# EAGLE design Athena-r1p0 (EAGLE 9.6.2)

## Sheet 1 of 6
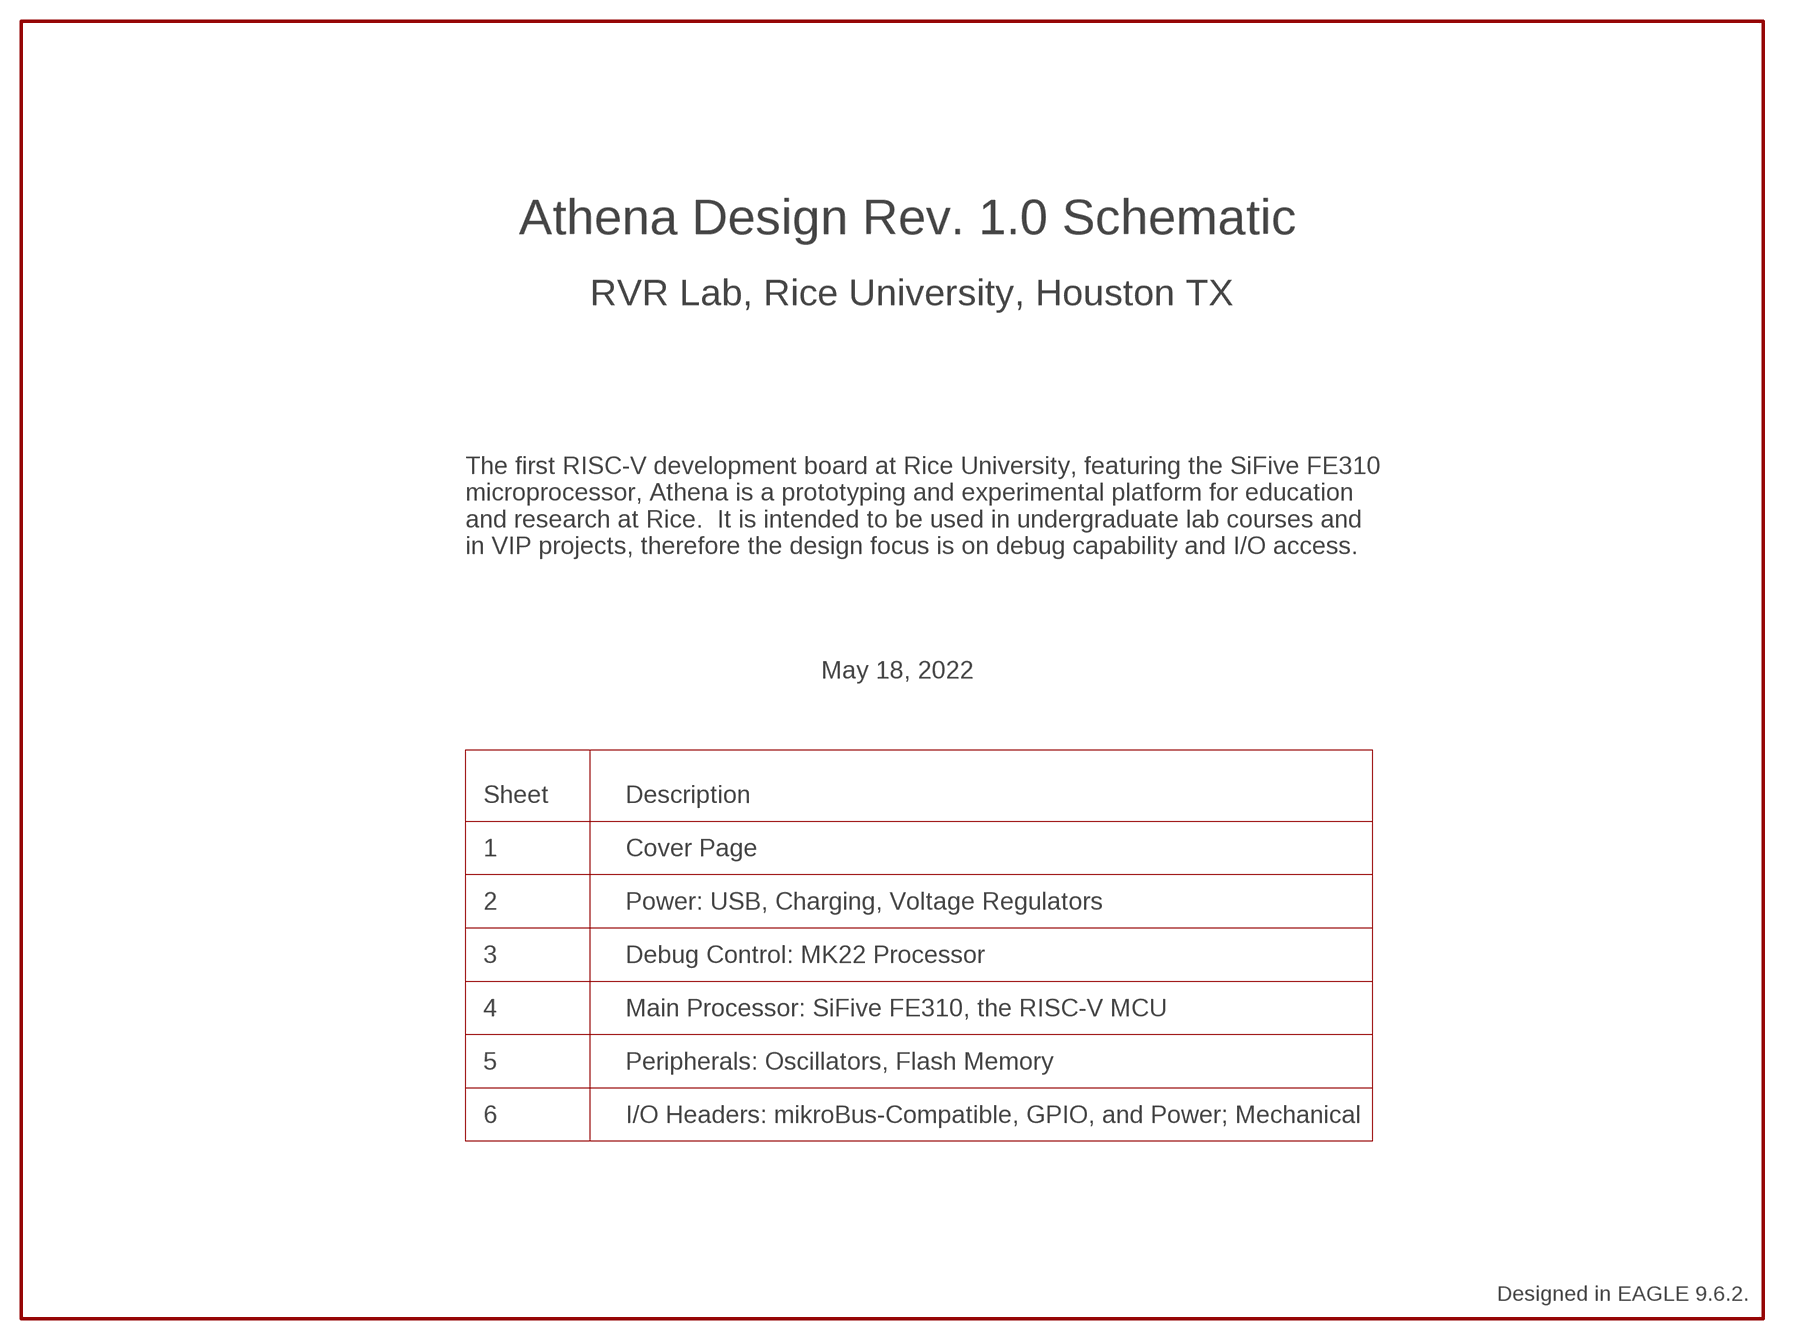
[diagram p0: schematic, sheet 1]

### Notes on the sheet
- Athena Design Rev. 1.0 Schematic
- RVR Lab, Rice University, Houston TX
- The first RISC-V development board at Rice University, featuring the SiFive FE310
  microprocessor, Athena is a prototyping and experimental platform for education
  and research at Rice.  It is intended to be used in undergraduate lab courses and
  in VIP projects, therefore the design focus is on debug capability and I/O access.
- May 18, 2022
- Sheet | Description
- 1 | Cover Page
- 2 | Power: USB, Charging, Voltage Regulators
- 3 | Debug Control: MK22 Processor
- 4 | Main Processor: SiFive FE310, the RISC-V MCU
- 5 | Peripherals: Oscillators, Flash Memory
- 6 | I/O Headers: mikroBus-Compatible, GPIO, and Power; Mechanical
- Designed in EAGLE 9.6.2.

## Sheet 2 of 6
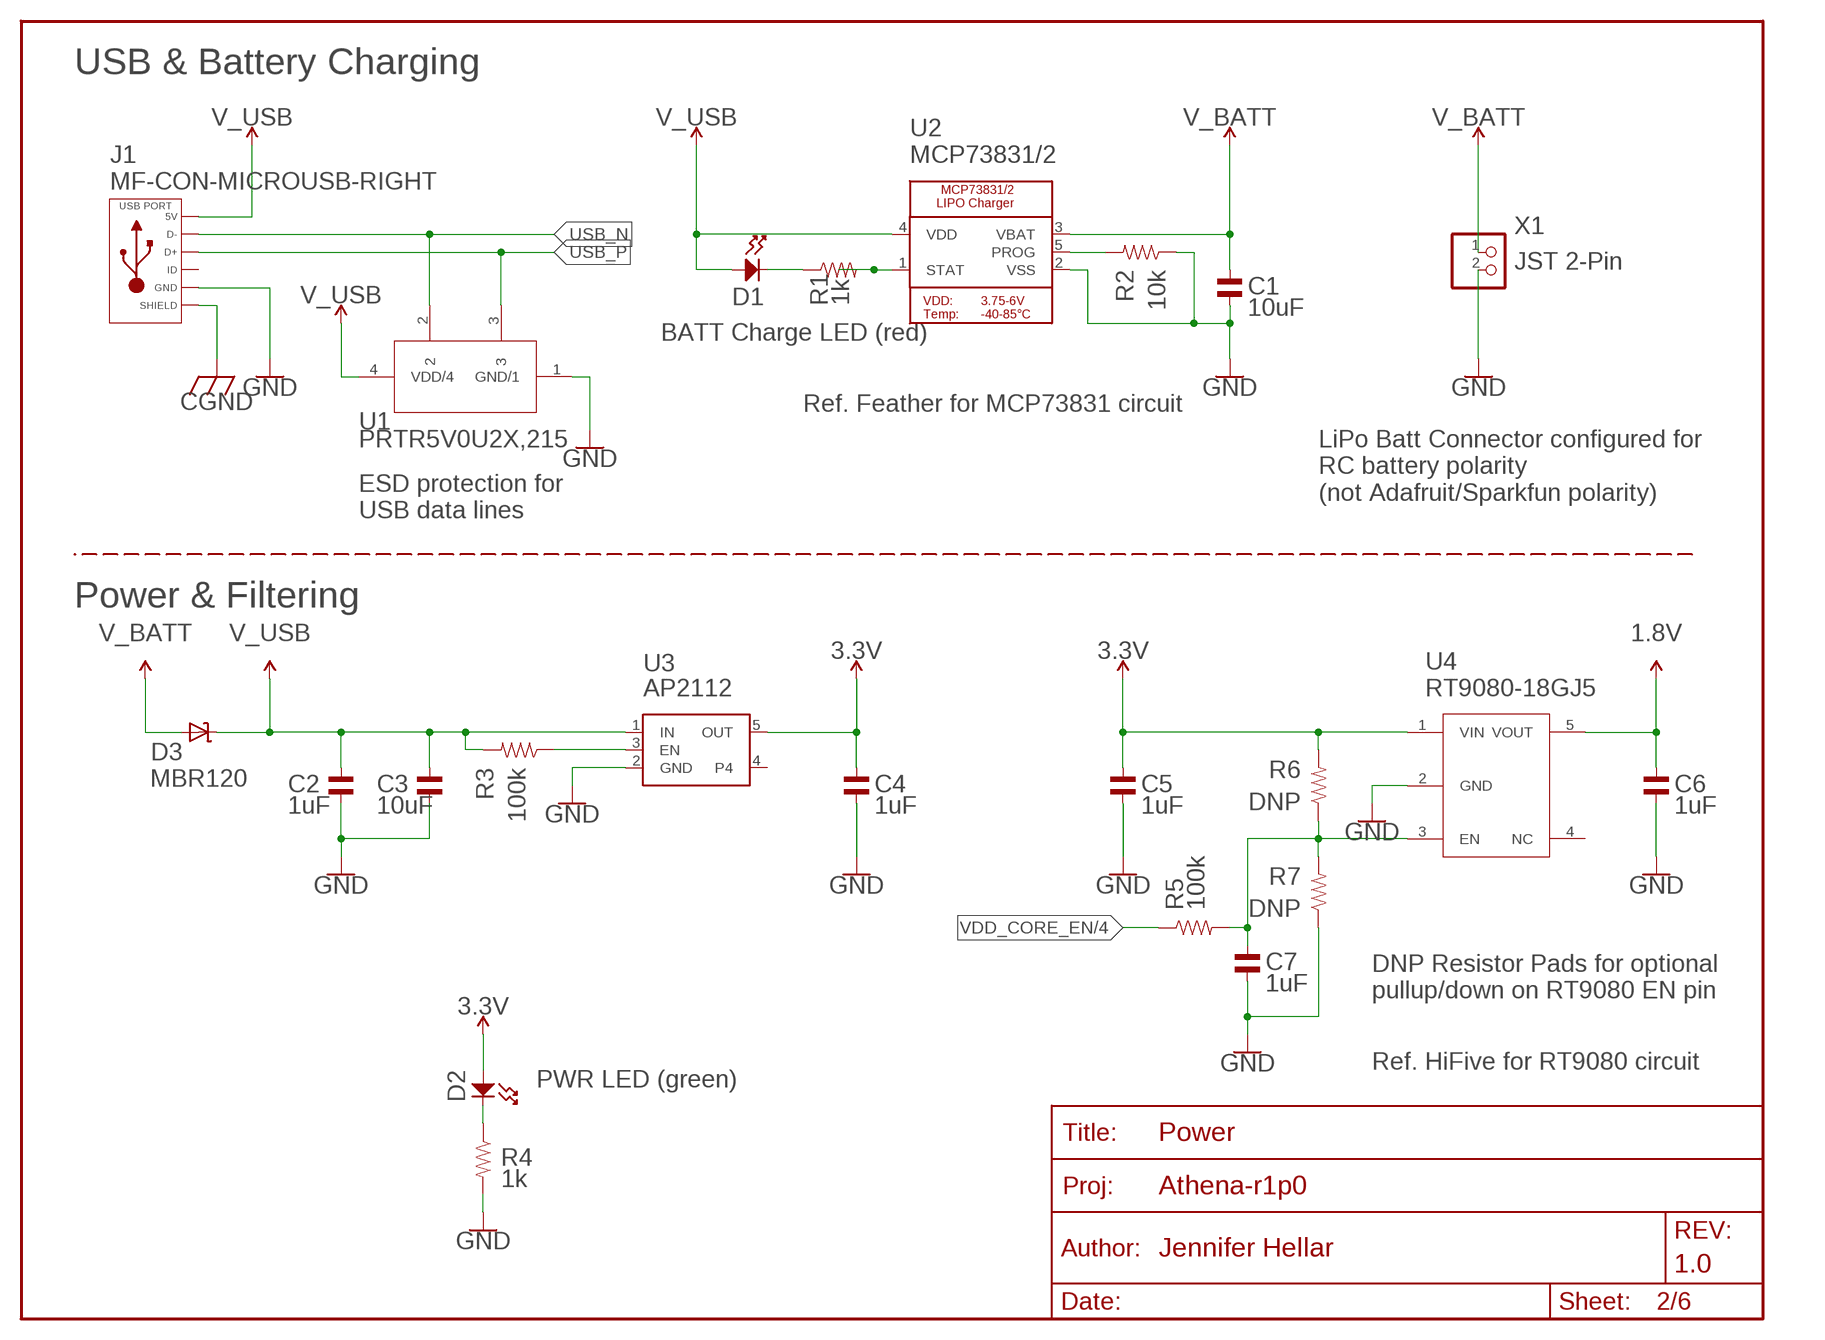
[diagram p1: schematic, sheet 2]
U$6 (FRAME): DESIGNER: Jennifer Hellar; REV: 1.0; SHEETNM: Power

### Parts
C1  10uF  CAPACITOR_NP_0402  [C0402]
C2  1uF  CAPACITOR_NP_0402  [C0402]
C3  10uF  CAPACITOR_NP_0402  [C0402]
C4  1uF  CAPACITOR_NP_0402  [C0402]
C5  1uF  CAPACITOR_NP_0402  [C0402]
C6  1uF  CAPACITOR_NP_0402  [C0402]
C7  1uF  CAPACITOR_NP_0402  [C0402]
D1  MF-LED-0805-RED  LED_SINGLE-0603-RED  [LED0603]
D2  MF-LED-0603-GREEN  LED_SINGLE-0603-GREEN  [LED0603]
D3  MBR120  DIODE-SCHOTTKYSOD-123  [SOD-123]
J1  MF-CON-MICROUSB-RIGHT  USB_MICRO_RIGHT  [MICROUSB-RIGHT]
R1  1k  RESISTOR_0402  [R0402]
R2  10k  RESISTOR_0402  [R0402]
R3  100k  RESISTOR_0402  [R0402]
R4  1k  RESISTOR_0402  [R0402]
R5  100k  RESISTOR_0402  [R0402]
R6  DNP  RESISTOR_0402  [R0402]
R7  DNP  RESISTOR_0402  [R0402]
U1  PRTR5V0U2X,215  [SOT143B_PRTR5V0U2X,215_NEX]
U2  MCP73831/2  [SOT23-5]
U3  AP2112  [SOT23-5]
U4  RT9080-18GJ5  [TSOT23-5_ONS]
X1  JST 2-Pin  CONNECTORS_BATT_JST_PH_2PIN  [JSTPH2]

### Nets
1.8V: C6.P$1 U4.5(VOUT) ; also sheet 4
3.3V: C4.P$1 C5.P$1 D2.ANODE R6.P$2 U3.5(OUT) U4.1(VIN) ; also sheet 3,4,5,6
CGND: J1.S1(SLD) J1.S2(SLD) J1.S3(SLD) J1.S4(SLD) J1.S5(SLD) J1.S6(SLD) ; also sheet 6
GND: C1.P$2 C2.P$2 C3.P$2 C4.P$2 C5.P$2 C6.P$2 C7.P$2 J1.5(GND) R2.P$1 R4.P$2 R7.P$1 U1.1(GND/1) U2.2(VSS) U3.2(GND) U4.2(GND) X1.2 ; also sheet 3,4,5,6
N$1: R3.P$1 U3.3(EN)
N$2: D2.CATHODE R4.P$1
N$3: D1.CATHODE R1.P$1
N$4: C7.P$1 R5.P$2 R6.P$1 R7.P$2 U4.3(EN)
N$5: R2.P$2 U2.5(PROG)
N$6: R1.P$2 U2.1(STAT)
USB_N [USB]: J1.2(D-) U1.2 ; also sheet 3
USB_P [USB]: J1.3(D+) U1.3 ; also sheet 3
V_BATT: C1.P$1 D3.A U2.3(VBAT) X1.1
V_USB: C2.P$1 C3.P$1 D1.ANODE D3.C J1.1(5V) R3.P$2 U1.4(VDD/4) U2.4(VDD) U3.1(IN) ; also sheet 6
VDD_CORE_EN: R5.P$1 ; also sheet 4
Unconnected: J1.4(ID) U3.4 U4.4(NC)

### Notes on the sheet
- USB & Battery Charging
- BATT Charge LED (red)
- Ref. Feather for MCP73831 circuit
- LiPo Batt Connector configured for 
  RC battery polarity 
  (not Adafruit/Sparkfun polarity)
- ESD protection for
  USB data lines
- Power & Filtering
- DNP Resistor Pads for optional
  pullup/down on RT9080 EN pin
- Ref. HiFive for RT9080 circuit
- PWR LED (green)

## Sheet 3 of 6
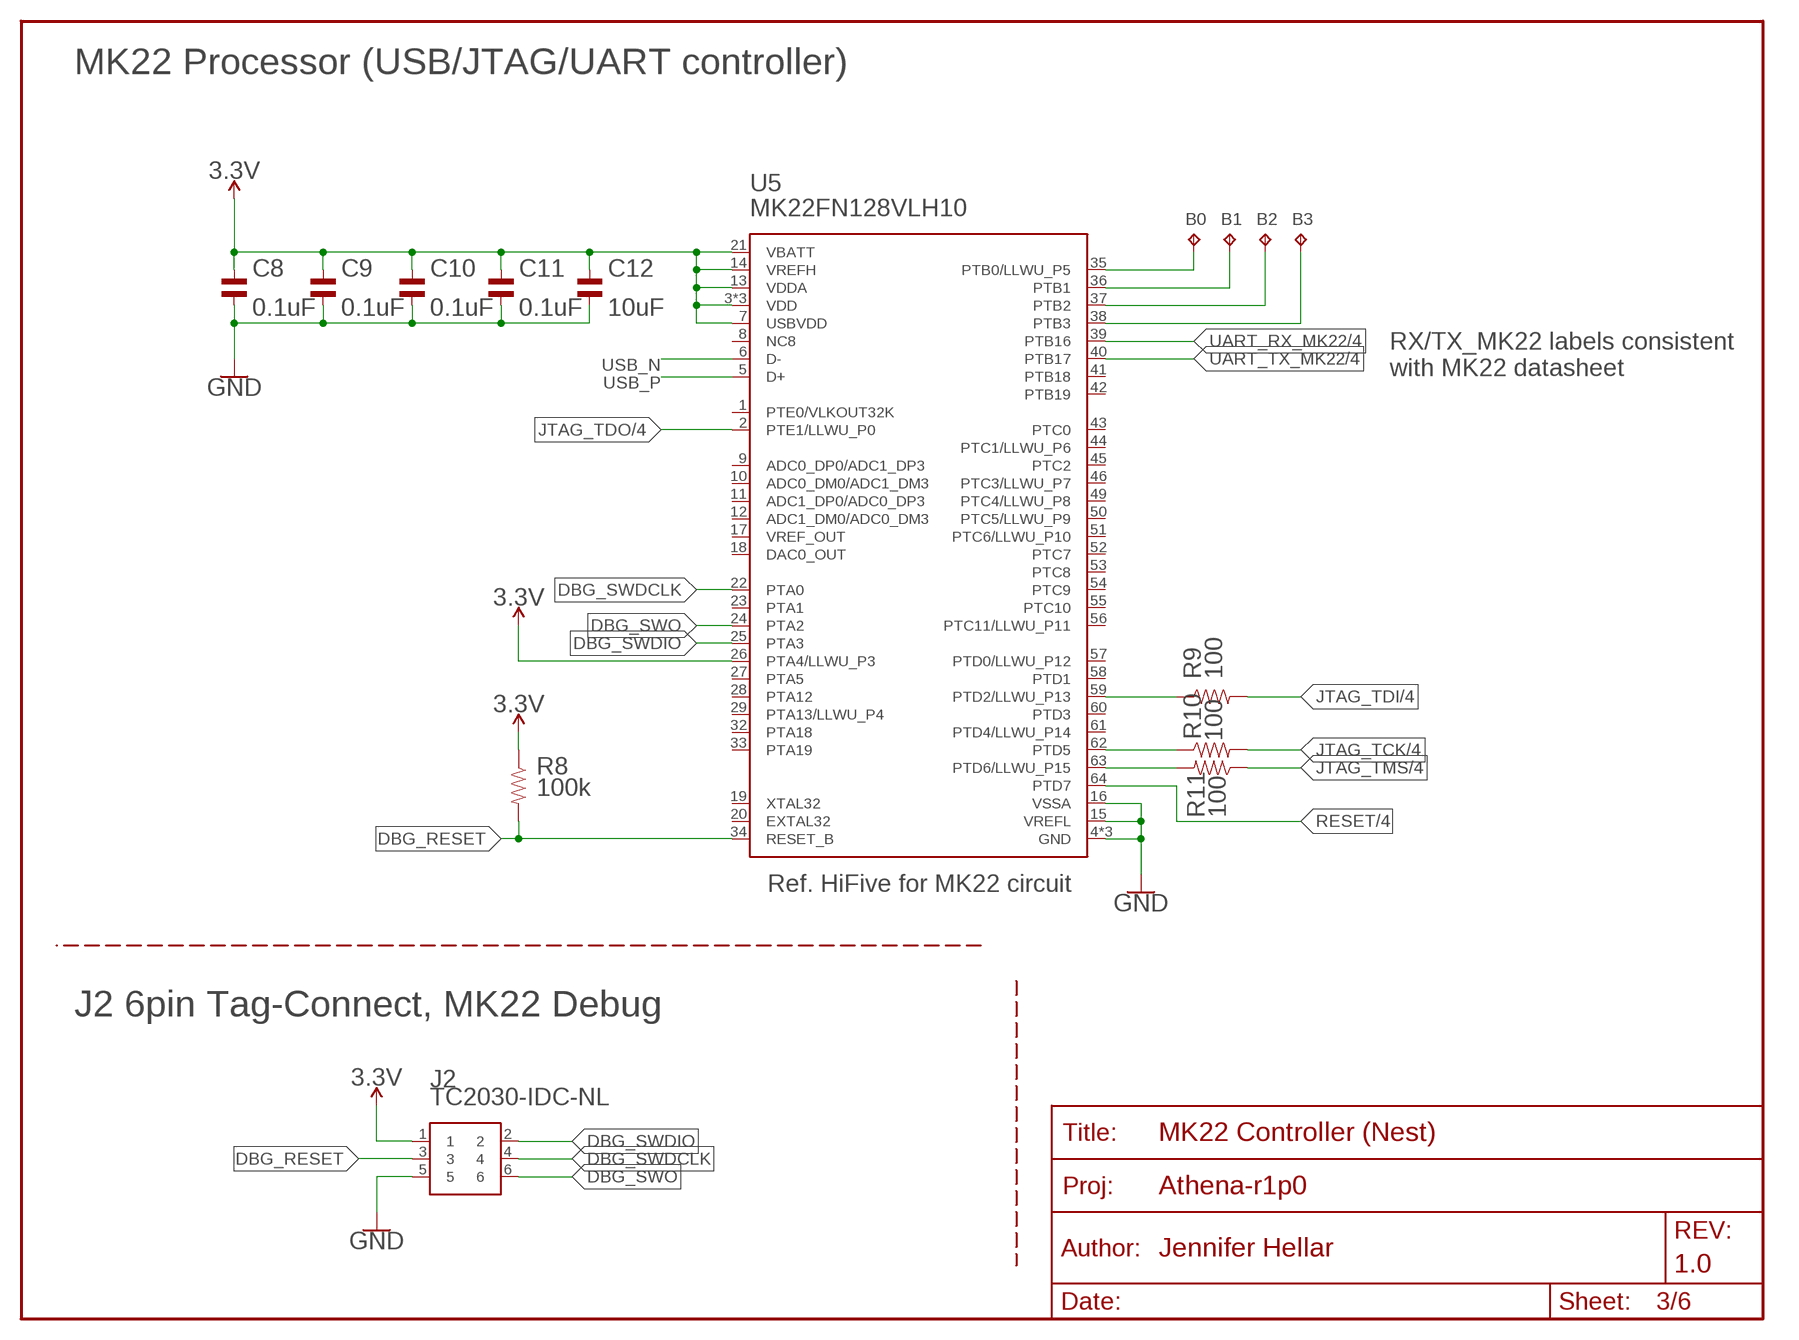
[diagram p2: schematic, sheet 3]
U$7 (FRAME): DESIGNER: Jennifer Hellar; REV: 1.0; SHEETNM: MK22 Controller (Nest)

### Parts
B0  TPB0,65  [TP_B0,65]
B1  TPB0,65  [TP_B0,65]
B2  TPB0,65  [TP_B0,65]
B3  TPB0,65  [TP_B0,65]
C8  0.1uF  CAPACITOR_NP_0402  [C0402]
C9  0.1uF  CAPACITOR_NP_0402  [C0402]
C10  0.1uF  CAPACITOR_NP_0402  [C0402]
C11  0.1uF  CAPACITOR_NP_0402  [C0402]
C12  10uF  CAPACITOR_NP_0402  [C0402]
J2  TC2030-IDC-NL  [TAG_TC2030-IDC-NL]
R8  100k  RESISTOR_0402  [R0402]
R9  100  RESISTOR_0402  [R0402]
R10  100  RESISTOR_0402  [R0402]
R11  100  RESISTOR_0402  [R0402]
U5  MK22FN128VLH10  [IC_USB_JTAG_LQFP-64]

### Nets
3.3V: C8.P$1 C9.P$1 C10.P$1 C11.P$1 C12.P$1 J2.1 R8.P$1 U5.3(VDD) U5.7(USBVDD) U5.13(VDDA) U5.14(VREFH) U5.21(VBATT) U5.26(PTA4/LLWU_P3) U5.30(VDD) U5.48(VDD) ; also sheet 2,4,5,6
DBG_RESET [USB]: J2.3 R8.P$2 U5.34(RESET_B)
DBG_SWDCLK: J2.4 U5.22(PTA0)
DBG_SWDIO: J2.2 U5.25(PTA3)
DBG_SWO: J2.6 U5.24(PTA2)
GND: C8.P$2 C9.P$2 C10.P$2 C11.P$2 C12.P$2 J2.5 U5.4(GND) U5.15(VREFL) U5.16(VSSA) U5.31(GND) U5.47(GND) ; also sheet 2,4,5,6
JTAG_TCK: R10.P$2 ; also sheet 4
JTAG_TDI: R9.P$2 ; also sheet 4
JTAG_TDO: U5.2(PTE1/LLWU_P0) ; also sheet 4
JTAG_TMS: R11.P$1 ; also sheet 4
N$8: R11.P$2 U5.63(PTD6/LLWU_P15)
N$9: R10.P$1 U5.62(PTD5)
N$11: R9.P$1 U5.59(PTD2/LLWU_P13)
N$12: B0.TP U5.35(PTB0/LLWU_P5)
N$13: B1.TP U5.36(PTB1)
N$14: B2.TP U5.37(PTB2)
N$15: B3.TP U5.38(PTB3)
RESET: U5.64(PTD7) ; also sheet 4,6
UART_RX_MK22: U5.39(PTB16) ; also sheet 4
UART_TX_MK22: U5.40(PTB17) ; also sheet 4
USB_N [USB]: U5.6(D-) ; also sheet 2
USB_P [USB]: U5.5(D+) ; also sheet 2
Unconnected: U5.1(PTE0/VLKOUT32K) U5.8(NC8) U5.9(ADC0_DP0/ADC1_DP3) U5.10(ADC0_DM0/ADC1_DM3) U5.11(ADC1_DP0/ADC0_DP3) U5.12(ADC1_DM0/ADC0_DM3) U5.17(VREF_OUT) U5.18(DAC0_OUT) U5.19(XTAL32) U5.20(EXTAL32) U5.23(PTA1) U5.27(PTA5) U5.28(PTA12) U5.29(PTA13/LLWU_P4) U5.32(PTA18) U5.33(PTA19) U5.41(PTB18) U5.42(PTB19) U5.43(PTC0) U5.44(PTC1/LLWU_P6) U5.45(PTC2) U5.46(PTC3/LLWU_P7) U5.49(PTC4/LLWU_P8) U5.50(PTC5/LLWU_P9) U5.51(PTC6/LLWU_P10) U5.52(PTC7) U5.53(PTC8) U5.54(PTC9) U5.55(PTC10) U5.56(PTC11/LLWU_P11) U5.57(PTD0/LLWU_P12) U5.58(PTD1) U5.60(PTD3) U5.61(PTD4/LLWU_P14)

### Notes on the sheet
- MK22 Processor (USB/JTAG/UART controller)
- RX/TX_MK22 labels consistent
  with MK22 datasheet
- Ref. HiFive for MK22 circuit
- J2 6pin Tag-Connect, MK22 Debug

## Sheet 4 of 6
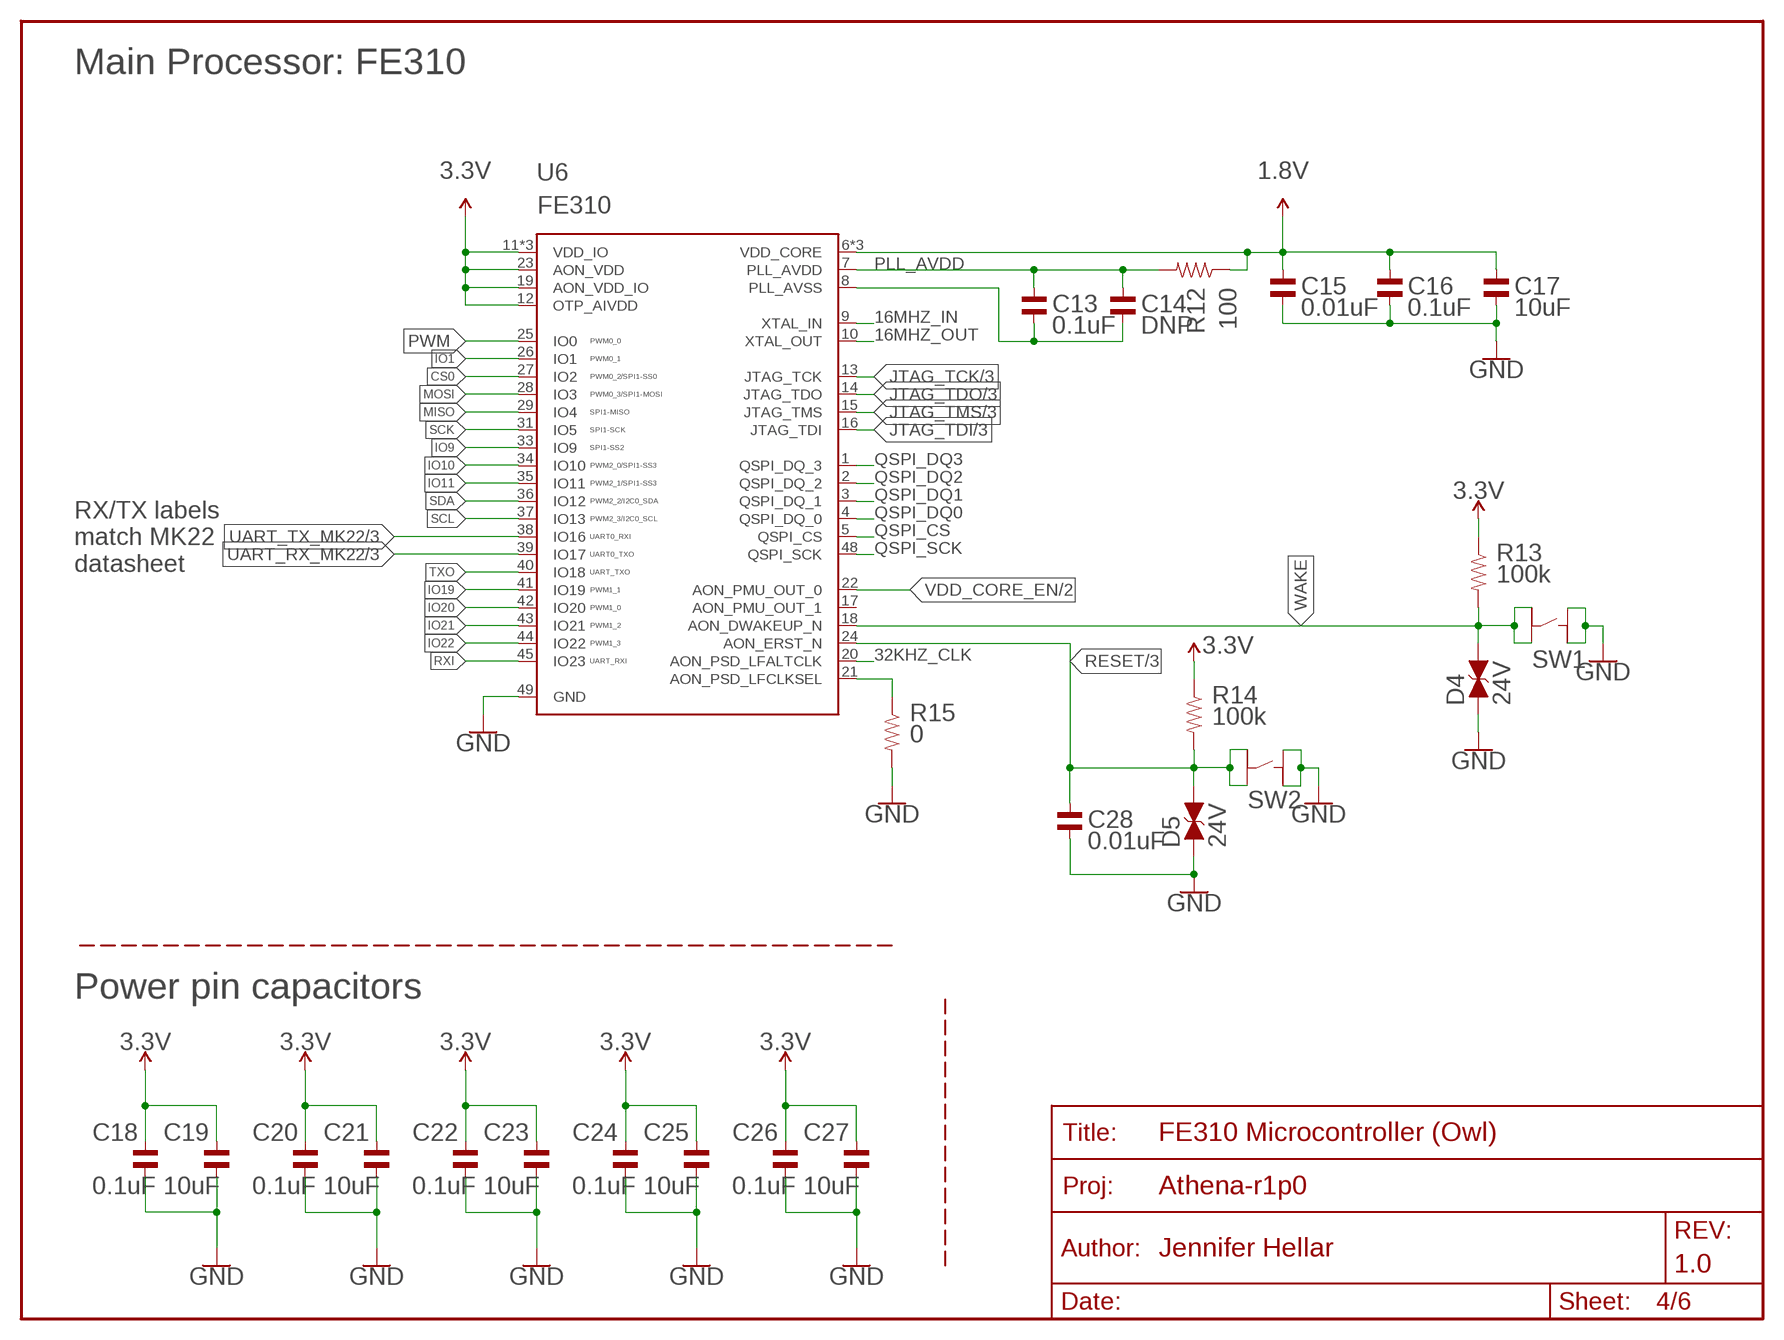
[diagram p3: schematic, sheet 4]
U$9 (FRAME): DESIGNER: Jennifer Hellar; REV: 1.0; SHEETNM: FE310 Microcontroller (Owl)

### Parts
C13  0.1uF  CAPACITOR_NP_0402  [C0402]
C14  DNP  CAPACITOR_NP_0402  [C0402]
C15  0.01uF  CAPACITOR_NP_0402  [C0402]
C16  0.1uF  CAPACITOR_NP_0402  [C0402]
C17  10uF  CAPACITOR_NP_0402  [C0402]
C18  0.1uF  CAPACITOR_NP_0402  [C0402]
C19  10uF  CAPACITOR_NP_0402  [C0402]
C20  0.1uF  CAPACITOR_NP_0402  [C0402]
C21  10uF  CAPACITOR_NP_0402  [C0402]
C22  0.1uF  CAPACITOR_NP_0402  [C0402]
C23  10uF  CAPACITOR_NP_0402  [C0402]
C24  0.1uF  CAPACITOR_NP_0402  [C0402]
C25  10uF  CAPACITOR_NP_0402  [C0402]
C26  0.1uF  CAPACITOR_NP_0402  [C0402]
C27  10uF  CAPACITOR_NP_0402  [C0402]
C28  0.01uF  CAPACITOR_NP_0402  [C0402]
D4  24V  PESD0603-240TVS0603  [TVS0603]
D5  24V  PESD0603-240TVS0603  [TVS0603]
R12  100  RESISTOR_0402  [R0402]
R13  100k  RESISTOR_0402  [R0402]
R14  100k  RESISTOR_0402  [R0402]
R15  0  RESISTOR_0402  [R0402]
SW1  MF-SW-TACT-6MM  TACT_4.2MM  [TACT4.2MM]
SW2  MF-SW-TACT-6MM  TACT_4.2MM  [TACT4.2MM]
U6  FE310  IC_MCU_SIFIVE_FE310  [MCU_QFN-48-.4MMPITCH]

### Nets
1.8V: C15.P$1 C16.P$1 C17.P$1 R12.P$1 U6.6(VDD_CORE) U6.30(VDD_CORE) U6.46(VDD_CORE) ; also sheet 2
3.3V: C18.P$1 C19.P$1 C20.P$1 C21.P$1 C22.P$1 C23.P$1 C24.P$1 C25.P$1 C26.P$1 C27.P$1 R13.P$1 R14.P$1 U6.11(VDD_IO) U6.12(OTP_AIVDD) U6.19(AON_VDD_IO) U6.23(AON_VDD) U6.32(VDD_IO) U6.47(VDD_IO) ; also sheet 2,3,5,6
16MHZ_IN: U6.9(XTAL_IN) ; also sheet 5
16MHZ_OUT: U6.10(XTAL_OUT) ; also sheet 5
32KHZ_CLK: U6.20(AON_PSD_LFALTCLK) ; also sheet 5
CS0: U6.27(IO2) ; also sheet 6
GND: C15.P$2 C16.P$2 C17.P$2 C18.P$2 C19.P$2 C20.P$2 C21.P$2 C22.P$2 C23.P$2 C24.P$2 C25.P$2 C26.P$2 C27.P$2 C28.P$2 D4.1(A) D5.1(A) R15.P$2 SW1.P$1 SW1.P$2 SW2.P$1 SW2.P$2 U6.49(GND) ; also sheet 2,3,5,6
IO1: U6.26(IO1) ; also sheet 6
IO9: U6.33(IO9) ; also sheet 6
IO10: U6.34(IO10) ; also sheet 6
IO11: U6.35(IO11) ; also sheet 6
IO19: U6.41(IO19) ; also sheet 6
IO20: U6.42(IO20) ; also sheet 6
IO21: U6.43(IO21) ; also sheet 6
IO22: U6.44(IO22) ; also sheet 6
JTAG_TCK: U6.13(JTAG_TCK) ; also sheet 3
JTAG_TDI: U6.16(JTAG_TDI) ; also sheet 3
JTAG_TDO: U6.14(JTAG_TDO) ; also sheet 3
JTAG_TMS: U6.15(JTAG_TMS) ; also sheet 3
MISO: U6.29(IO4) ; also sheet 6
MOSI: U6.28(IO3) ; also sheet 6
N$7: R15.P$1 U6.21(AON_PSD_LFCLKSEL)
N$10: C13.P$2 C14.P$2 U6.8(PLL_AVSS)
PLL_AVDD: C13.P$1 C14.P$1 R12.P$2 U6.7(PLL_AVDD)
PWM: U6.25(IO0) ; also sheet 6
QSPI_CS [QSPI]: U6.5(QSPI_CS) ; also sheet 5
QSPI_DQ0 [QSPI]: U6.4(QSPI_DQ_0) ; also sheet 5
QSPI_DQ1 [QSPI]: U6.3(QSPI_DQ_1) ; also sheet 5
QSPI_DQ2 [QSPI]: U6.2(QSPI_DQ_2) ; also sheet 5
QSPI_DQ3 [QSPI]: U6.1(QSPI_DQ_3) ; also sheet 5
QSPI_SCK [QSPI]: U6.48(QSPI_SCK) ; also sheet 5
RESET: C28.P$1 D5.2(C) R14.P$2 SW2.P$3 SW2.P$4 U6.24(AON_ERST_N) ; also sheet 3,6
RXI: U6.45(IO23) ; also sheet 6
SCK: U6.31(IO5) ; also sheet 6
SCL: U6.37(IO13) ; also sheet 6
SDA: U6.36(IO12) ; also sheet 6
TXO: U6.40(IO18) ; also sheet 6
UART_RX_MK22: U6.39(IO17) ; also sheet 3
UART_TX_MK22: U6.38(IO16) ; also sheet 3
VDD_CORE_EN: U6.22(AON_PMU_OUT_0) ; also sheet 2
WAKE: D4.2(C) R13.P$2 SW1.P$3 SW1.P$4 U6.18(AON_DWAKEUP_N) ; also sheet 6
Unconnected: U6.17(AON_PMU_OUT_1)

### Notes on the sheet
- Main Processor: FE310
- RX/TX labels
  match MK22
  datasheet
- Power pin capacitors

## Sheet 5 of 6
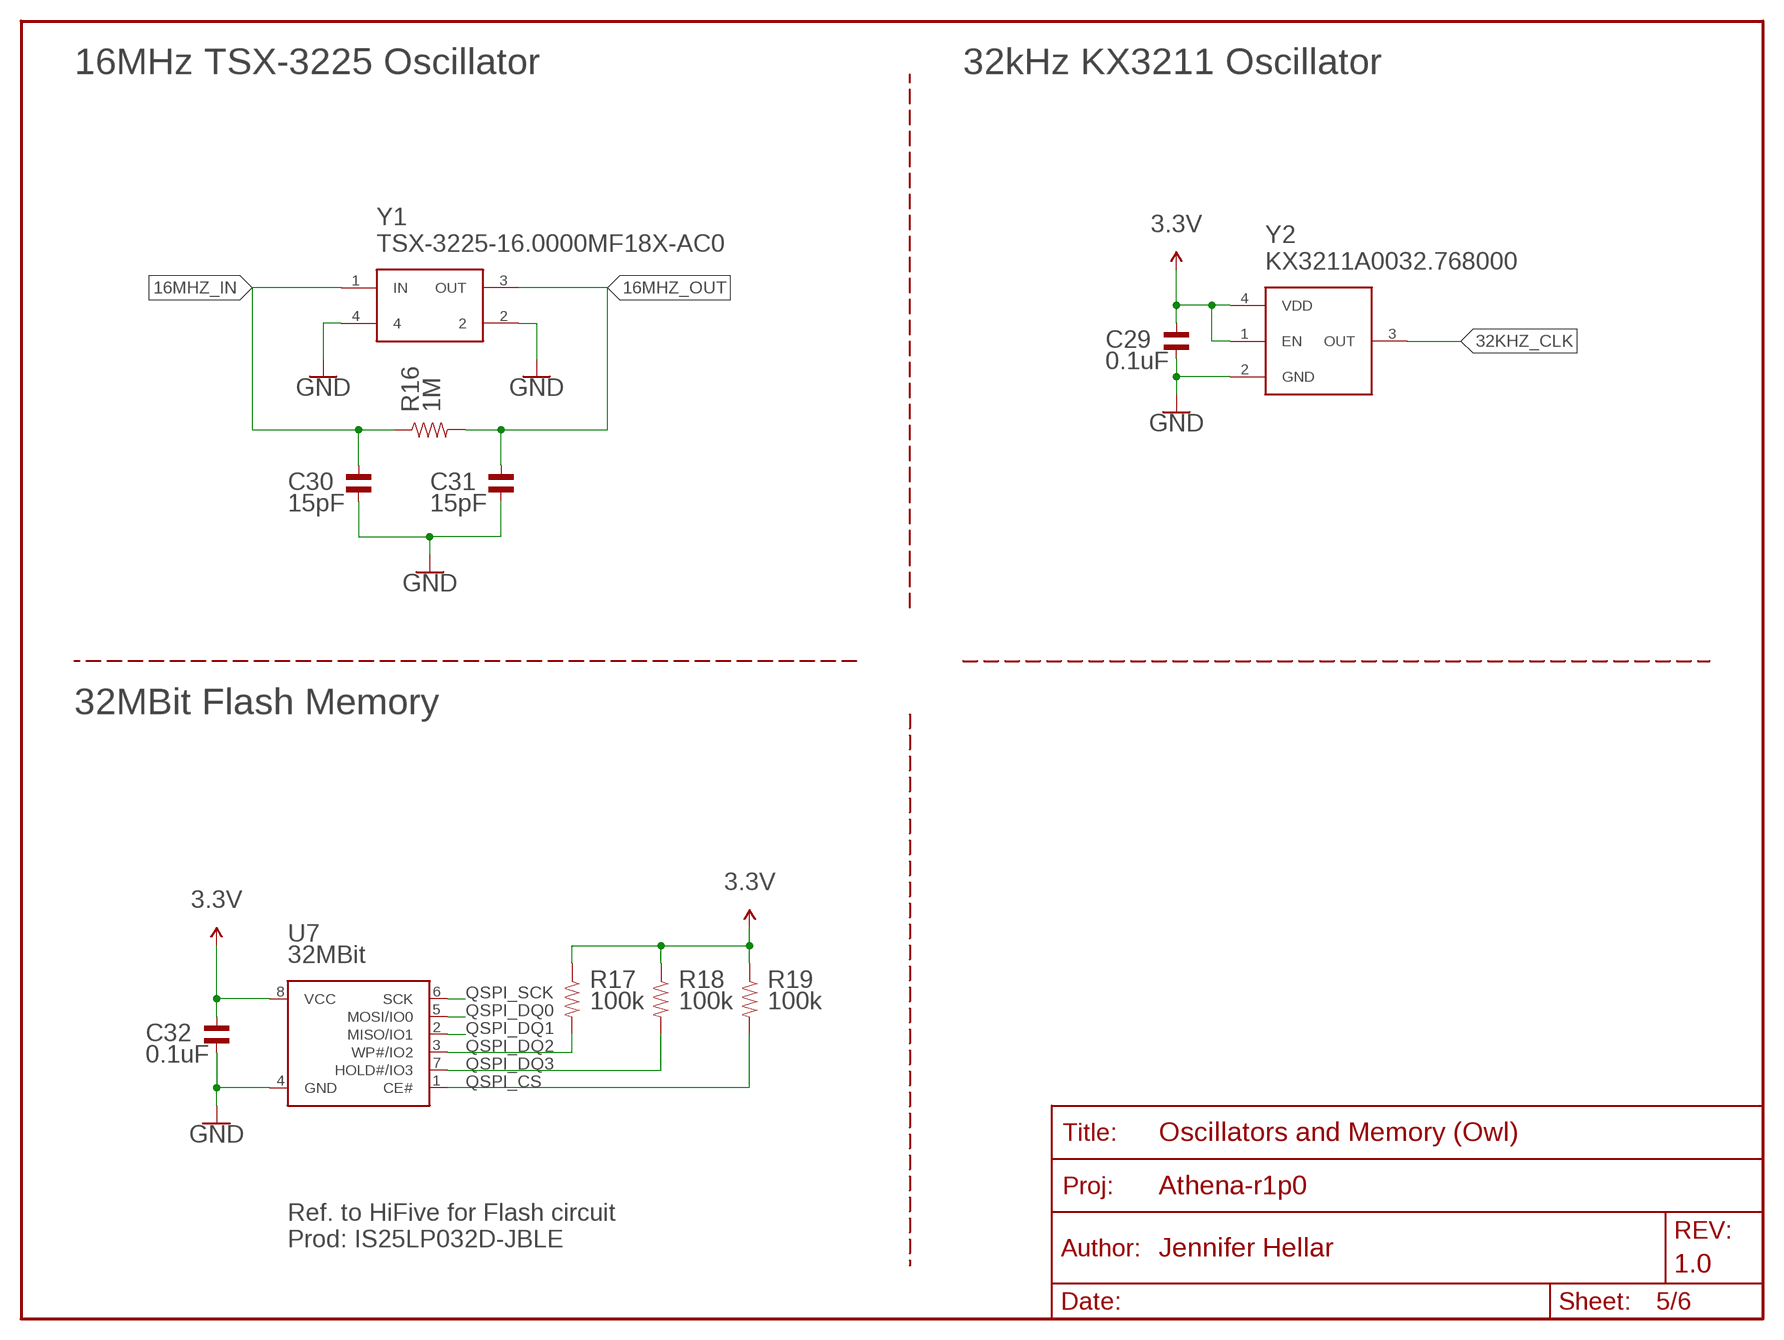
[diagram p4: schematic, sheet 5]
U$10 (FRAME): DESIGNER: Jennifer Hellar; REV: 1.0; SHEETNM: Oscillators and Memory (Owl)

### Parts
C29  0.1uF  CAPACITOR_NP_0402  [C0402]
C30  15pF  CAPACITOR_NP_0402  [C0402]
C31  15pF  CAPACITOR_NP_0402  [C0402]
C32  0.1uF  CAPACITOR_NP_0402  [C0402]
R16  1M  RESISTOR_0402  [R0402]
R17  100k  RESISTOR_0402  [R0402]
R18  100k  RESISTOR_0402  [R0402]
R19  100k  RESISTOR_0402  [R0402]
U7  32MBit  IC_MEMORY_QSPI32MBIT  [IC-MEMORY_SO08]
Y1  TSX-3225-16.0000MF18X-AC0  [SMD-4]
Y2  KX3211A0032.768000  [SMD-4]

### Nets
3.3V: C29.P$1 C32.P$1 R17.P$1 R18.P$1 R19.P$1 U7.8(VCC) Y2.1(EN) Y2.4(VDD) ; also sheet 2,3,4,6
16MHZ_IN: C30.P$1 R16.P$1 Y1.1(IN) ; also sheet 4
16MHZ_OUT: C31.P$1 R16.P$2 Y1.3(OUT) ; also sheet 4
32KHZ_CLK: Y2.3(OUT) ; also sheet 4
GND: C29.P$2 C30.P$2 C31.P$2 C32.P$2 U7.4(GND) Y1.2 Y1.4 Y2.2(GND) ; also sheet 2,3,4,6
QSPI_CS [QSPI]: R19.P$2 U7.1(CE#) ; also sheet 4
QSPI_DQ0 [QSPI]: U7.5(MOSI/IO0) ; also sheet 4
QSPI_DQ1 [QSPI]: U7.2(MISO/IO1) ; also sheet 4
QSPI_DQ2 [QSPI]: R17.P$2 U7.3(WP#/IO2) ; also sheet 4
QSPI_DQ3 [QSPI]: R18.P$2 U7.7(HOLD#/IO3) ; also sheet 4
QSPI_SCK [QSPI]: U7.6(SCK) ; also sheet 4

### Notes on the sheet
- 16MHz TSX-3225 Oscillator | 32kHz KX3211 Oscillator
- 32MBit Flash Memory
- Ref. to HiFive for Flash circuit
  Prod: IS25LP032D-JBLE

## Sheet 6 of 6
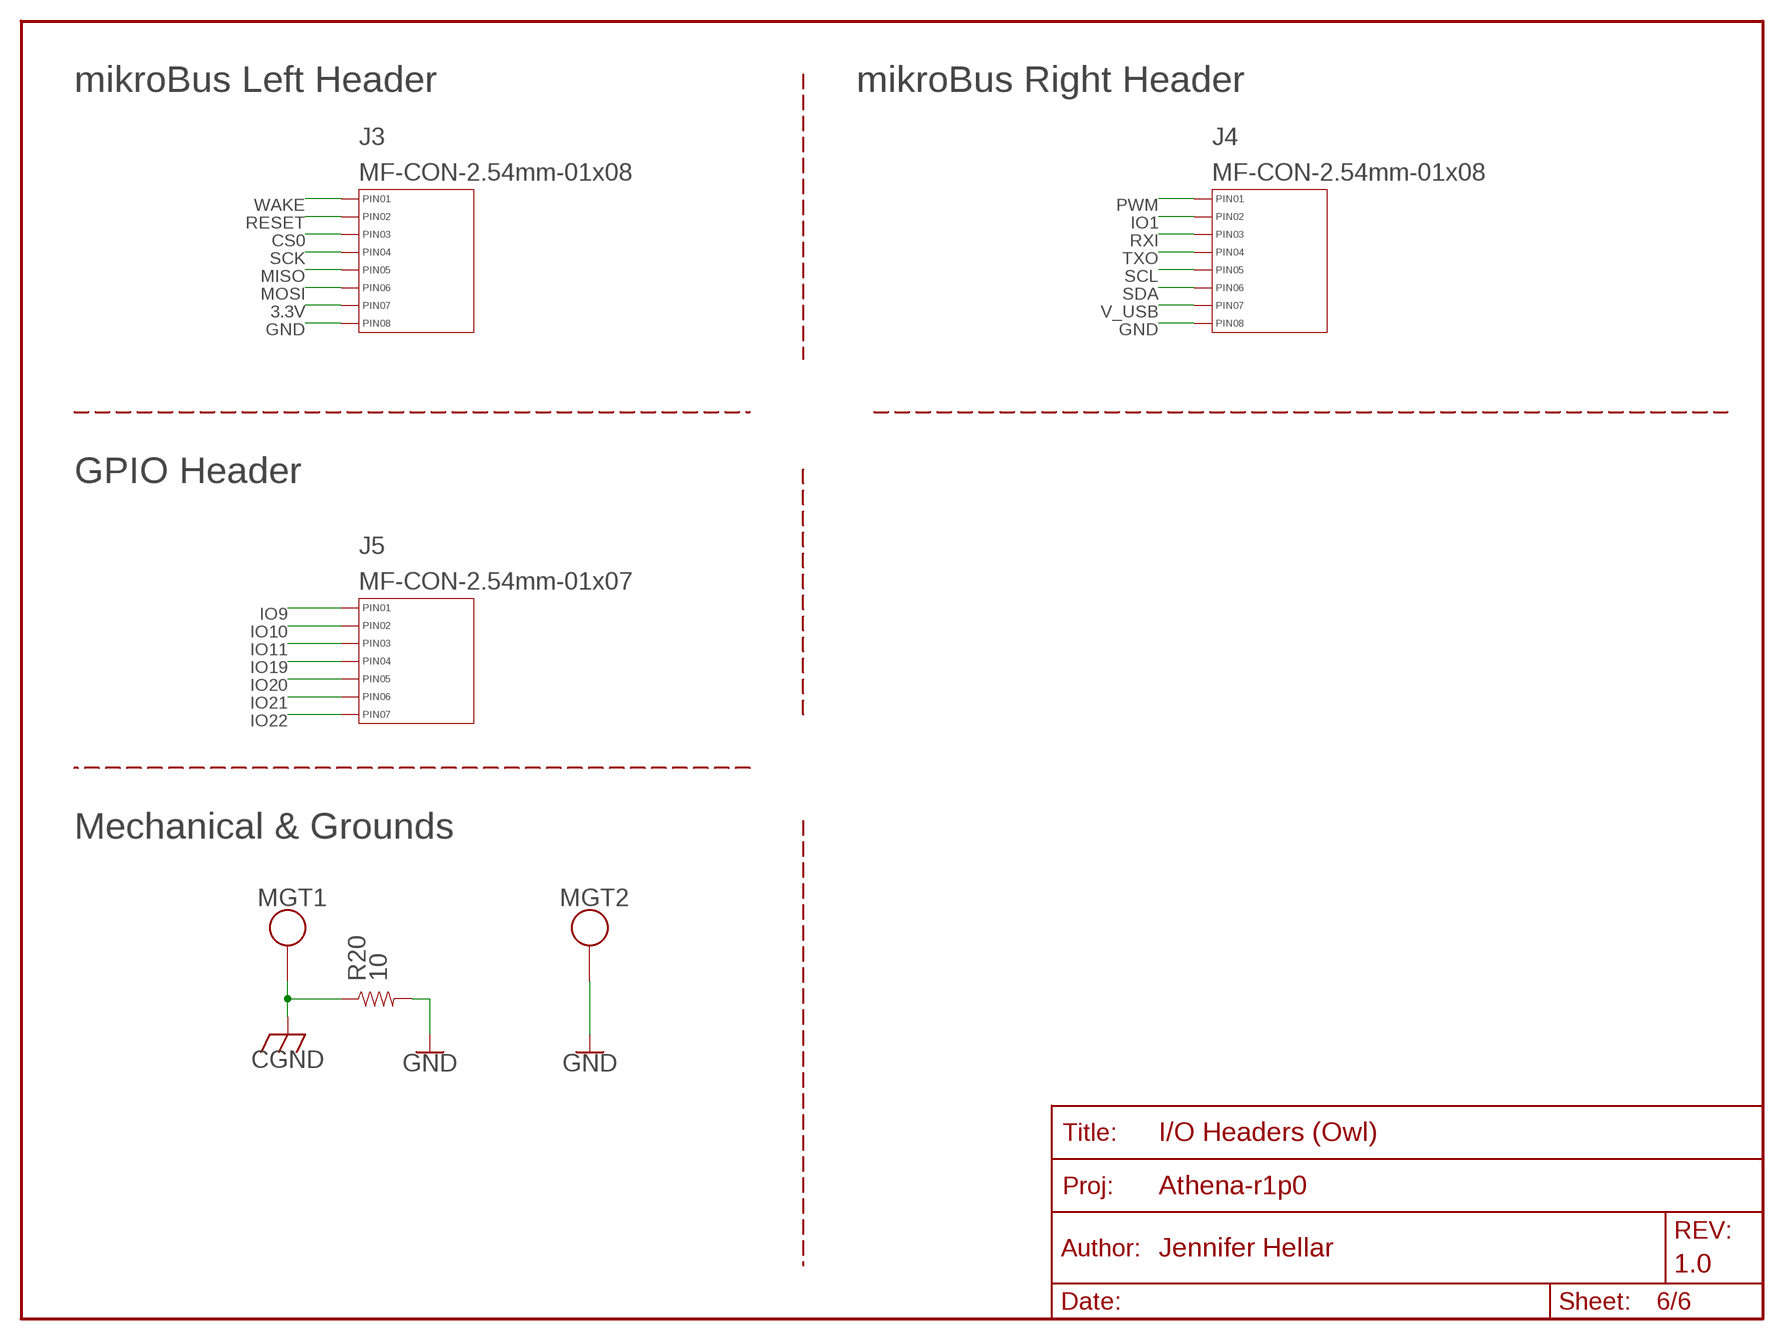
[diagram p5: schematic, sheet 6]
U$11 (FRAME): DESIGNER: Jennifer Hellar; REV: 1.0; SHEETNM: I/O Headers (Owl)

### Parts
J3  MF-CON-2.54mm-01x08  CON_01X08_PTH_2.54MM  [PTH_2.54MM_01X08]
J4  MF-CON-2.54mm-01x08  CON_01X08_PTH_2.54MM  [PTH_2.54MM_01X08]
J5  MF-CON-2.54mm-01x07  CON_01X07_PTH_2.54MM  [PTH_2.54MM_01X07]
MGT1  MOUNTING_HOLE  [MOUNTING_HOLE]
MGT2  MOUNTING_HOLE  [MOUNTING_HOLE]
R20  10  RESISTOR_0402  [R0402]

### Nets
3.3V: J3.P$7(PIN7) ; also sheet 2,3,4,5
CGND: MGT1.P$1 R20.P$1 ; also sheet 2
CS0: J3.P$3(PIN3) ; also sheet 4
GND: J3.P$8(PIN8) J4.P$8(PIN8) MGT2.P$1 R20.P$2 ; also sheet 2,3,4,5
IO1: J4.P$2(PIN2) ; also sheet 4
IO9: J5.P$1(PIN1) ; also sheet 4
IO10: J5.P$2(PIN2) ; also sheet 4
IO11: J5.P$3(PIN3) ; also sheet 4
IO19: J5.P$4(PIN4) ; also sheet 4
IO20: J5.P$5(PIN5) ; also sheet 4
IO21: J5.P$6(PIN6) ; also sheet 4
IO22: J5.P$7(PIN7) ; also sheet 4
MISO: J3.P$5(PIN5) ; also sheet 4
MOSI: J3.P$6(PIN6) ; also sheet 4
PWM: J4.P$1(PIN1) ; also sheet 4
RESET: J3.P$2(PIN2) ; also sheet 3,4
RXI: J4.P$3(PIN3) ; also sheet 4
SCK: J3.P$4(PIN4) ; also sheet 4
SCL: J4.P$5(PIN5) ; also sheet 4
SDA: J4.P$6(PIN6) ; also sheet 4
TXO: J4.P$4(PIN4) ; also sheet 4
V_USB: J4.P$7(PIN7) ; also sheet 2
WAKE: J3.P$1(PIN1) ; also sheet 4

### Notes on the sheet
- mikroBus Left Header | mikroBus Right Header
- GPIO Header
- Mechanical & Grounds

## Library data of the parts
B0 B1-B3 = Athena-r1p0:TP: Test pad
C1 C3 C12 C17 C19 C21 C23 C25 C27 = Athena-r1p0:CAPACITOR_NP: Library: MF_Passives Description: Device for Non-Polarized Capacitors. Manufacture part number (MPN) can be added via Attributes. Check https://factory.macrofab.com/parts for the house parts list.; MPN: CL05A106MP8NUB8; POPULATE: 1
C2 C4-C11 C13-C16 C18 C20 C22 C24 C26 C28 C29 C32 = Athena-r1p0:CAPACITOR_NP: Library: MF_Passives Description: Device for Non-Polarized Capacitors. Manufacture part number (MPN) can be added via Attributes. Check https://factory.macrofab.com/parts for the house parts list.; POPULATE: 1
C30 C31 = Athena-r1p0:CAPACITOR_NP: Library: MF_Passives Description: Device for Non-Polarized Capacitors. Manufacture part number (MPN) can be added via Attributes. Check https://factory.macrofab.com/parts for the house parts list.; MPN: CL05C150JB5NNNC; POPULATE: 1
D1 = Athena-r1p0:LED_SINGLE: Library: MF_LEDs Description: Device for Single LED Packages. Manufacture part number (MFG#) can be added via Attributes.; HOUSEPART: YES; MPN: MF-LED-0805-RED; POPULATE: 1; URL: https://factory.macrofab.com/part/MF-LED-0805-RED
D2 = Athena-r1p0:LED_SINGLE: Library: MF_LEDs Description: Device for Single LED Packages. Manufacture part number (MFG#) can be added via Attributes.; HOUSEPART: YES; MPN: MF-LED-0603-GREEN; POPULATE: 1; URL: https://factory.macrofab.com/part/MF-LED-0603-GREEN
D3 = Athena-r1p0:DIODE-SCHOTTKY
D4 D5 = Athena-r1p0:PESD0603-240; PROD_ID: DIO-14502
J1 = Athena-r1p0:USB: Library: MF_Connectors Description: 5 Pin USB Connectors. SLD is the shield connection. Usually tied to ground through a small ferrite bead.; HOUSEPART: YES; HUOSEPART: NO; POPULATE: 1; URL: http://www.4uconnector.com/online/object/4udrawing/20236.pdf
J2 = Athena-r1p0:TC2030-IDC-NL: CABLE ADAPTER 6 POS Check prices <https://pricing.snapeda.com/parts/TC2030-IDC-NL/Tag-Connect/view-part?ref=eda>; AVAILABILITY: No availability data; DESCRIPTION: 6-PIN PLUG-OF-NAILS CABLE 6; MF: Tag-Connect; MP: TC2030-IDC-NL; PACKAGE: None; PRICE: None
J3 J4 = Athena-r1p0:CON_01X08: Library: MF_Connectors Description: Header Connector with 8 Positions and 01 Rows. Use the LABEL Attribute to label the pin on the schematic and PCB. You can remove the attributes on the PCB by using the SMASH function on the part and then deleting the text.; HOUSEPART: YES; MPN: MF-CON-2.54mm-01x08; POPULATE: 1; URL: https://factory.macrofab.com/part/MF-CON-2.54mm-01x08
J5 = Athena-r1p0:CON_01X07: Library: MF_Connectors Description: Header Connector with 7 Positions and 01 Rows. Use the LABEL Attribute to label the pin on the schematic and PCB. You can remove the attributes on the PCB by using the SMASH function on the part and then deleting the text.; HOUSEPART: YES; MPN: MF-CON-2.54mm-01x07; POPULATE: 1; URL: https://factory.macrofab.com/part/MF-CON-2.54mm-01x07
MGT1 MGT2 = Athena-r1p0:MOUNTING_HOLE: Chassis Mounting Hole w/GND connection ability
R1-R20 = Athena-r1p0:RESISTOR: Library: MF_Passives Description: Device for Resistors. Manufacture part number (MPN), Voltage, Tolerance, and Wattage Rating can be added via Attributes. Check https://factory.macrofab.com/parts for the house parts list.
SW1 SW2 = Athena-r1p0:TACT: Library: MF_Switches Description: Device for Tact Switches. Manufacture part number (MFG#) can be added via Attributes.; HOUSEPART: YES; MPN: MF-SW-TACT-6MM; POPULATE: 1; URL: https://factory.macrofab.com/part/MF-SW-TACT-6MM
U1 = Athena-r1p0:PRTR5V0U2X,215; COPYRIGHT: Copyright (C) 2021 Ultra Librarian. All rights reserved.; MANUFACTURER_PART_NUMBER: PRTR5V0U2X,215; MFR_NAME: Nexperia
U2 = Athena-r1p0:MCP73831/2: MCP73831/2 LIPO Charger VDD: 3.75 - 6V Temp -40 - 85°C Programmable Charge Rate: 15-500mA NOTE: STAT is a tri-state logic output on the MCP73831 and an open-drain output on the MCP73832. SOT23-5 with 4.2V output and tri-state logic on STAT = MCP73831T-2ACI/OT
U3 = Athena-r1p0:AP2112: SOT23-5 Fixed Voltage Regulators Part Current Out V Out V In V Dropout θJA (°C/W) TJ (°C) Digikey Part No. ADP121 150mA 3.3V 3.4-5.5V 0.09V @ 150mA -- -- ADP121-AUJZ33R7CT-ND ADP121 150mA 3.0V 3.1-5.5V 0.09V @ 150mA -- -- ADP121-AUJZ30R7CT-ND ADP122 300mA 3.3V 3.4-5.5V 0.085V @ 300mA -- -- ADP122AUJZ-3.3-R7CT-ND ADP1712 300mA 3.3V 3.5-5.5V 0.17V @ 300mA -- -- ADP1712AUJZ-3.3-R7TR-ND AP7311 (Low Cost) 150mA 3.3V 3.5-6V 0.15V @ 150mA -- -- AP7311-33WG-7DICT-ND LD39015M18R 150mA 1.8V 1.9V-5.5V 0.08V @ 100mA -- -- 497-6977-1-ND LP2985A-33DBVR 150mA 3.3V 3.3-16V 0.28V @ 150mA 206 150 296-18479-1-ND MCP1824T-3302E/OT 300mA 3.3V 3.5V-6V 0.2V @ 300mA -- -- MCP1824T-3302E/OTCT-ND MIC5205-2.5YM5 TR 150mA 2.5V 2.7-16V 0.165V @ 150mA -- -- 576-1257-2-ND MIC5205-3.0YM5 TR 150mA 3.0V 3.2V-16V 0.165V @ 150mA -- -- 576-1258-2-ND MIC5205-3.3YM5 TR 150mA 3.3V 3.5V-16V 0.165V @ 150mA -- -- 576-1259-2-ND TPS780330220 150mA 3.3V+2.2V 3.6-5.5V 250mV Max -- -- 296-23332-1-ND TDA3663/N1,135 100mA 3.3V 3.5-45V 0.18V @ 50mA -- -- 568-5343-1-ND Max operating temp can be calculated using θJA, TJ (max junction temperature), and power in watts. Set the "Maximum Ambient Temperature" until it reaches TJ ("Max Junction Temperature"), which is the absolute limit for safe use of the regulator: Heat Sink Temperature Calculator <http://www.daycounter.com/Calculators/Heat-Sink-Temperature-Calculator.phtml> For example, With 12V source into a 3.3V LP2985 and a 30mA load, we are dissipating (12V-3.3V) * 0.03A = 0.261W. With a θJA of 206 °C/W, a TJ of 150°C, and 261mW we can safely use the chip without a heat sink up to 75°C (=147.1°C Junction Temperature).
U4 = Athena-r1p0:RT9080-18GJ5
U5 = Athena-r1p0:MK22FN128VLH10: The Kinetis K22 product family members are optimized for costsensitive applications requiring low-power, USB connectivity, high peripheral integration and processing efficiency with a floating-point unit. These devices share the comprehensive enablement and scalability of the Kinetis family.; PROD_ID: IC-14611
U6 = Athena-r1p0:IC_MCU_SIFIVE_FE310: SiFive FE310 - RISC-V MCU The FE310-G002 is the second Freedom E300 SoC. The FE310-G002 is built around the E31 Core Complex instantiated in the Freedom E300 platform.; PROD_ID: IC-14494
U7 = Athena-r1p0:IC_MEMORY_QSPI32MBIT: Integrated Silicon Solution Inc. IS25LP032D The IS25LP032D Serial Flash memory offers a versatile storage solution with high flexibility and performance in a simplified pin count package. ISSI’s “Industry Standard Serial Interface” Flash is for systems that require limited space, a low pin count, and low power consumption. The device is accessed through a 4-wire SPI Interface consisting of a Serial Data Input (SI), Serial Data Output (SO), Serial Clock (SCK), and Chip Enable (CE#) pins, which can also be configured to serve as multi-I/O (see pin descriptions). Datasheet <http://www.issi.com/WW/pdf/25LP-WP032D.pdf>; PROD_ID: IC-14501
X1 = Athena-r1p0:CONNECTORS_BATT_JST_PH_2PIN: JST 2-Pin Right-Angle Connector PH-Series - 4UConnector: 17311 SH-Series - 4UConnector: 07278
Y1 = Athena-r1p0:TSX-3225-16.0000MF18X-AC0
Y2 = Athena-r1p0:KX3211A0032.768000

## Board
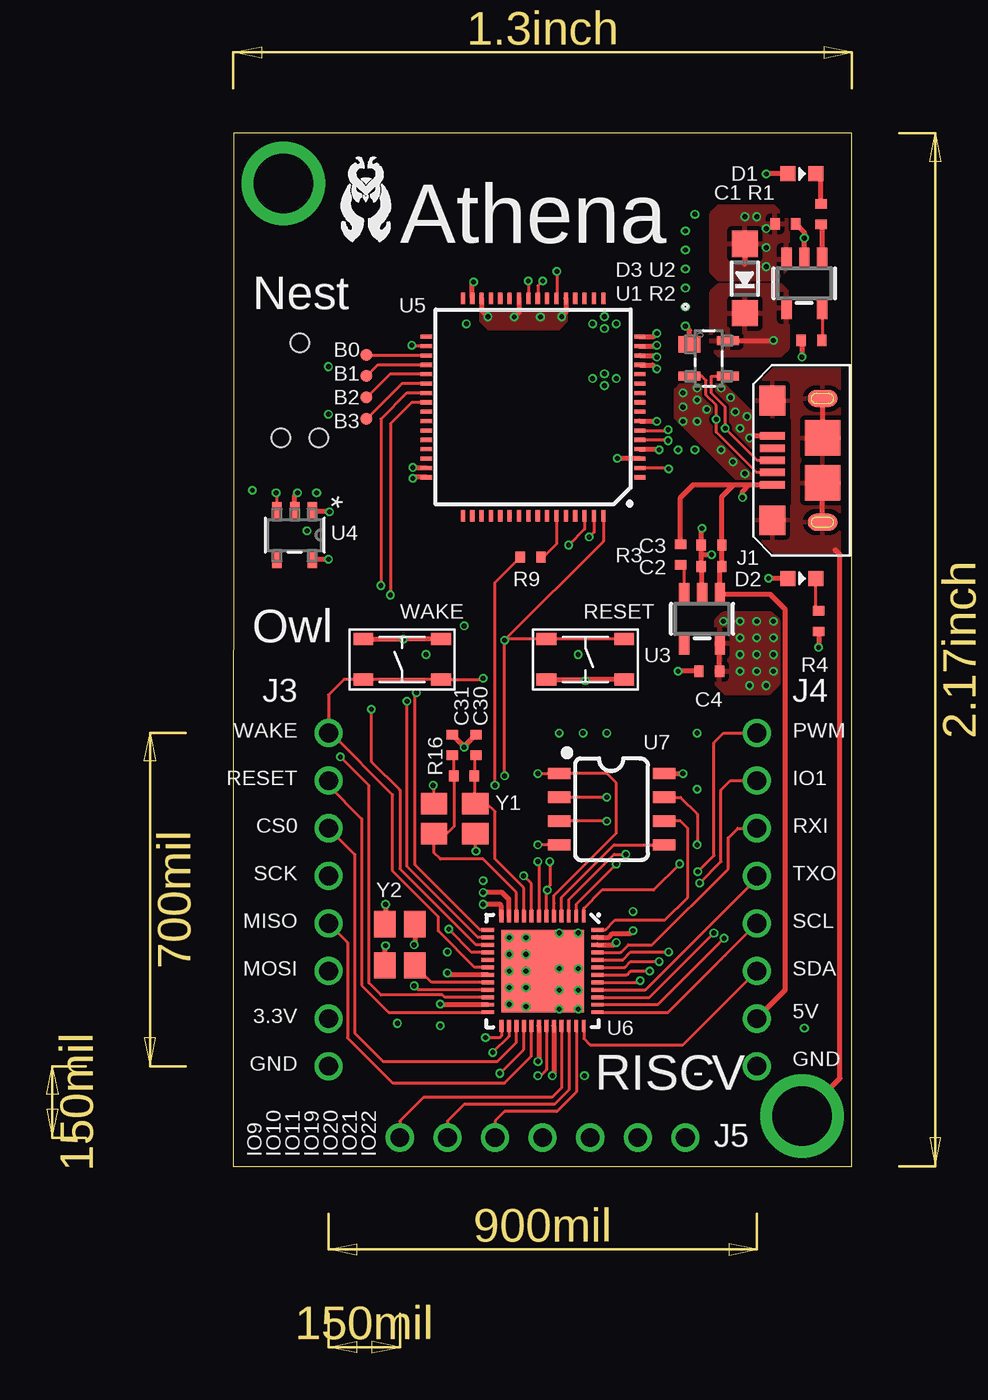
[diagram p6: board, top side]
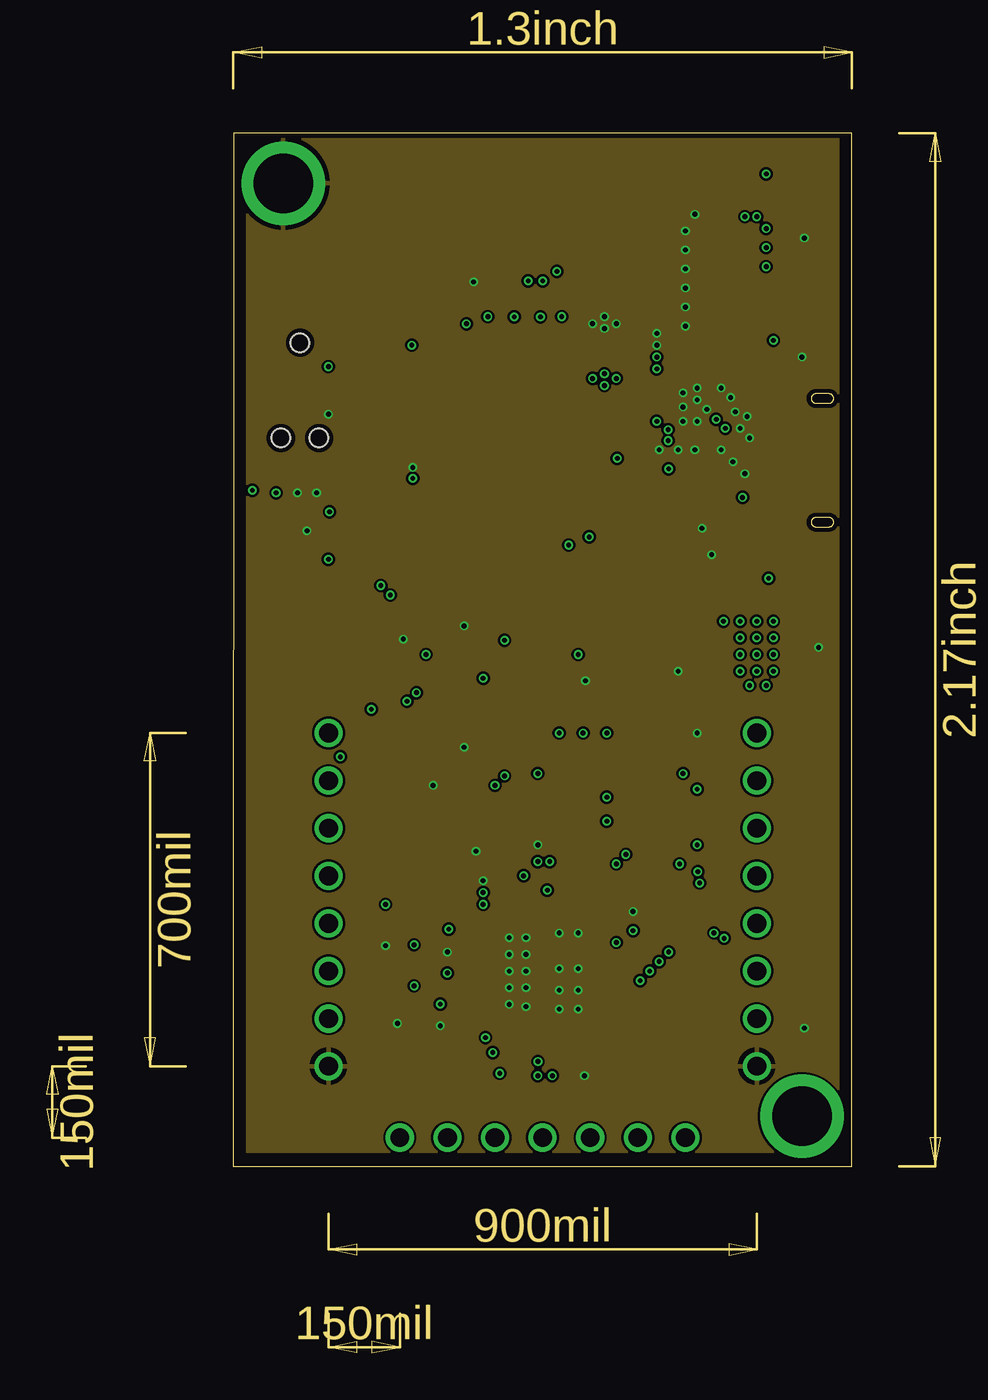
[diagram p7: board, inner layer Route2]
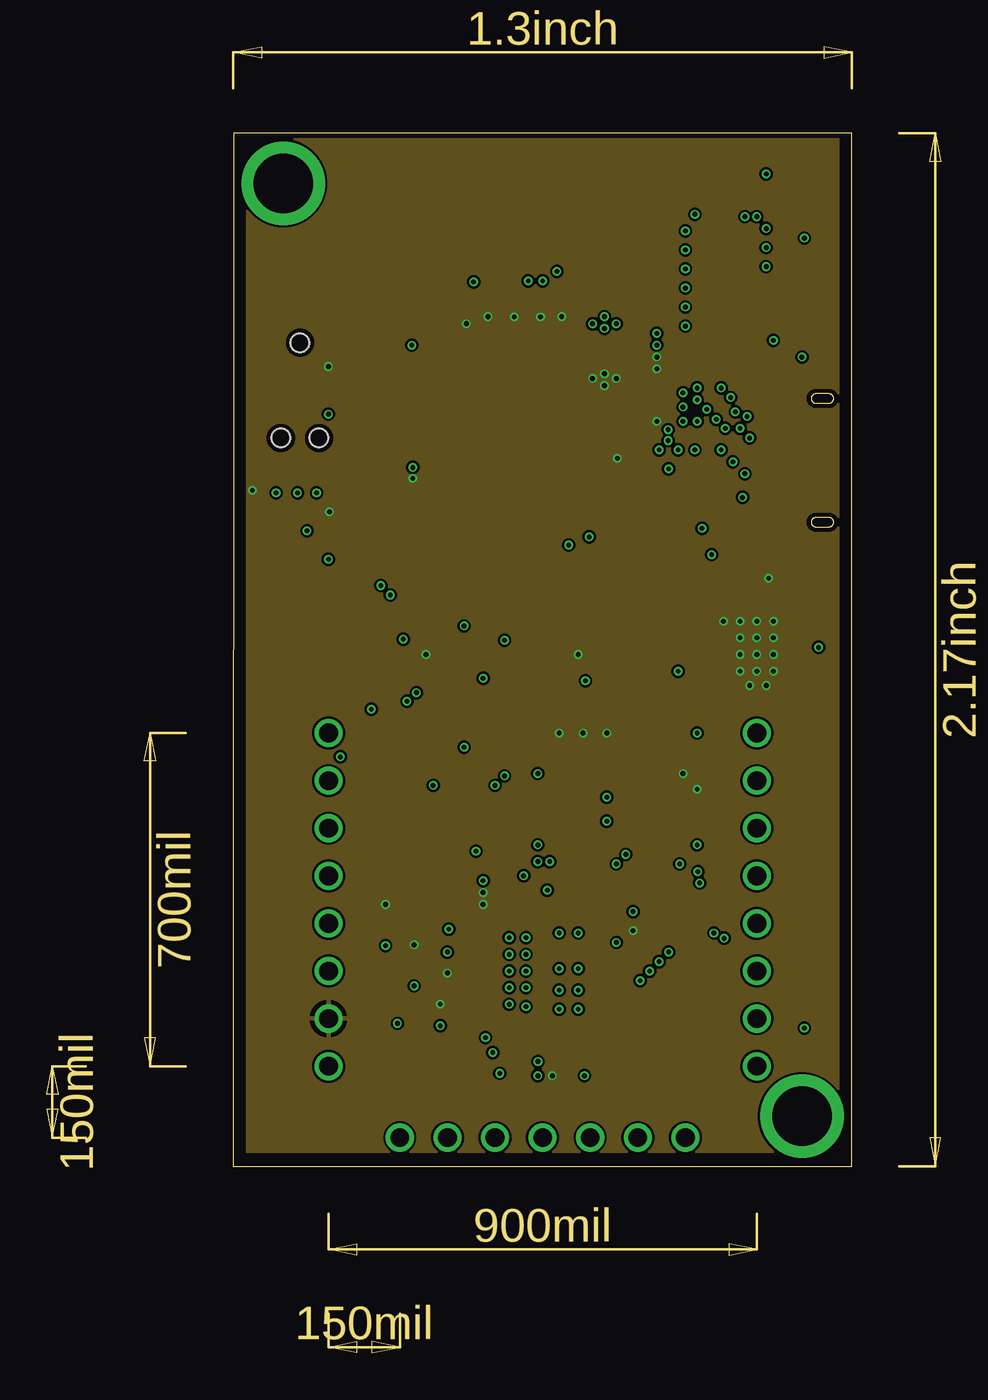
[diagram p8: board, inner layer Route15]
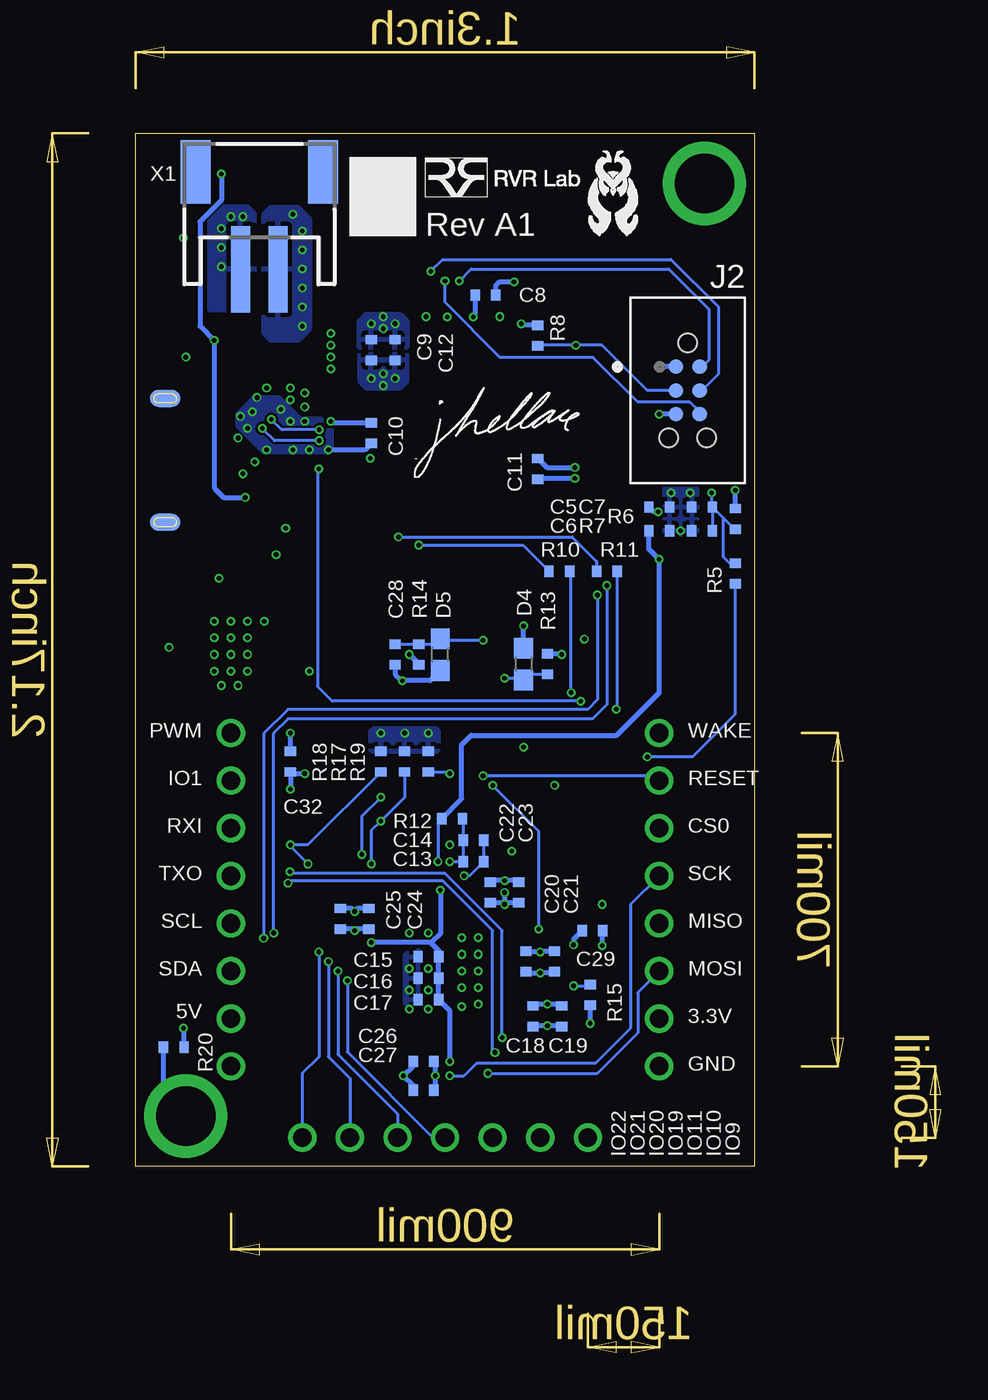
[diagram p9: board, bottom side, seen from below]

Size 33.02 x 55.12 mm. Coordinates in mm from the lower left corner, seen from the top.
Outline: 0,0 33.02,0 33.02,55.12 0.01,55.12 0,0
Copper layers (1*2*15*16): Top 0.035mm / dielectric 0.23mm / Route2 0.035mm / dielectric 0.93mm / Route15 0.035mm / dielectric 0.23mm / Bottom 0.035mm
Design rules "MF_Standard_4_Layer": minimum track width 5mil, minimum drill 10mil, track to track 5mil, track to pad 5mil, pad to pad 5mil, via to via 5mil, smd to smd 0mil, copper to edge 10mil, drill to drill 10mil, minimum pad ring 4mil, minimum via ring 4mil, stop-mask expansion 2mil, vias tented up to drill 25mil, thermal gap 10mil

### Footprints (pad centres in the part's own frame; a part is rotated, then mirrored left to right if it is on the bottom)
TP_B0,65 = smd 0.635 x 0.635: TP 0,0
C0402 = smd 0.5 x 0.6: P$1 -0.55,0; P$2 0.55,0
LED0603 = smd 0.8 x 0.8: ANODE 0.75,0; CATHODE -0.75,0
SOD-123 = smd 1.4 x 1.4: A 1.85,0; C -1.85,0
TVS0603 = smd 1.1 x 1: 1 -0.85,0; 2 0.85,0
MICROUSB-RIGHT = smd 0.4 x 1.35: 1 -1.3,1.27; 2 -0.65,1.27; 3 0,1.27; 4 0.65,1.27; 5 1.3,1.27 | smd 0.9 x 1.6: S1 -3.3,-1.4; S2 3.3,-1.4 | smd 1.6 x 1.4: S3 -3.2,1.27; S4 3.2,1.27 | smd 1.9 x 1.9: S5 -1.2,-1.405; S6 1.2,-1.405 | smd 0.9 x 1.6 bottom: S7 -3.3,-1.4; S8 3.3,-1.4
TAG_TC2030-IDC-NL = smd 0.787 x 0.787: 1 -1.27,-0.635; 2 -1.27,0.635; 3 0,-0.635; 4 0,0.635; 5 1.27,-0.635; 6 1.27,0.635 | hole 0.991: -2.54,0; 2.54,1.016; 2.54,-1.016
PTH_2.54MM_01X08 = drill 1: P$1 -8.89,0; P$2 -6.35,0; P$3 -3.81,0; P$4 -1.27,0; P$5 1.27,0; P$6 3.81,0; P$7 6.35,0; P$8 8.89,0
PTH_2.54MM_01X07 = drill 1: P$1 -7.62,0; P$2 -5.08,0; P$3 -2.54,0; P$4 0,0; P$5 2.54,0; P$6 5.08,0; P$7 7.62,0
MOUNTING_HOLE = drill 3.175 pad 4.445: P$1 0,0
R0402 = smd 0.5 x 0.6: P$1 -0.55,0; P$2 0.55,0
TACT4.2MM = smd 1.05 x 0.65: P$1 -2.075,1.075; P$2 2.075,1.075; P$3 -2.075,-1.075; P$4 2.075,-1.075
SOT143B_PRTR5V0U2X,215_NEX = smd 0.889 x 1.168: 1 -0.747,-1.021 | smd 0.483 x 1.168: 2 0.95,-1.021; 3 0.95,1.021; 4 -0.95,1.021
SOT23-5 = smd 0.55 x 1.2: 1 -0.95,-1.3; 2 0,-1.3; 3 0.95,-1.3; 4 0.95,1.3; 5 -0.95,1.3
TSOT23-5_ONS = smd 0.953 x 0.508: 1 -1.276,0.95; 2 -1.276,0; 3 -1.276,-0.95; 4 1.276,-0.95; 5 1.276,0.95
IC_USB_JTAG_LQFP-64 = smd 0.6 x 0.22: 1 -5.7,3.75; 2 -5.7,3.25; 3 -5.7,2.75; 4 -5.7,2.25; 5 -5.7,1.75; 6 -5.7,1.25; 7 -5.7,0.75; 8 -5.7,0.25; 9 -5.7,-0.25; 10 -5.7,-0.75; 11 -5.7,-1.25; 12 -5.7,-1.75; 13 -5.7,-2.25; 14 -5.7,-2.75; 15 -5.7,-3.25; 16 -5.7,-3.75; 33 5.7,-3.75; 34 5.7,-3.25; 35 5.7,-2.75; 36 5.7,-2.25; 37 5.7,-1.75; 38 5.7,-1.25; 39 5.7,-0.75; 40 5.7,-0.25; 41 5.7,0.25; 42 5.7,0.75; 43 5.7,1.25; 44 5.7,1.75; 45 5.7,2.25; 46 5.7,2.75; 47 5.7,3.25; 48 5.7,3.75 | smd 0.22 x 0.6: 17 -3.75,-5.8; 18 -3.25,-5.8; 19 -2.75,-5.8; 20 -2.25,-5.8; 21 -1.75,-5.8; 22 -1.25,-5.8; 23 -0.75,-5.8; 24 -0.25,-5.8; 25 0.25,-5.8; 26 0.75,-5.8; 27 1.25,-5.8; 28 1.75,-5.8; 29 2.25,-5.8; 30 2.75,-5.8; 31 3.25,-5.8; 32 3.75,-5.8; 49 3.75,5.8; 50 3.25,5.8; 51 2.75,5.8; 52 2.25,5.8; 53 1.75,5.8; 54 1.25,5.8; 55 0.75,5.8; 56 0.25,5.8; 57 -0.25,5.8; 58 -0.75,5.8; 59 -1.25,5.8; 60 -1.75,5.8; 61 -2.25,5.8; 62 -2.75,5.8; 63 -3.25,5.8; 64 -3.75,5.8
MCU_QFN-48-.4MMPITCH = smd 0.65 x 0.2: 1 -2.925,2.2; 2 -2.925,1.8; 3 -2.925,1.4; 4 -2.925,1; 5 -2.925,0.6; 6 -2.925,0.2; 7 -2.925,-0.2; 8 -2.925,-0.6; 9 -2.925,-1; 10 -2.925,-1.4; 11 -2.925,-1.8; 12 -2.925,-2.2; 25 2.925,-2.2; 26 2.925,-1.8; 27 2.925,-1.4; 28 2.925,-1; 29 2.925,-0.6; 30 2.925,-0.2; 31 2.925,0.2; 32 2.925,0.6; 33 2.925,1; 34 2.925,1.4; 35 2.925,1.8; 36 2.925,2.2 | smd 0.2 x 0.65: 13 -2.2,-2.925; 14 -1.8,-2.925; 15 -1.4,-2.925; 16 -1,-2.925; 17 -0.6,-2.925; 18 -0.2,-2.925; 19 0.2,-2.925; 20 0.6,-2.925; 21 1,-2.925; 22 1.4,-2.925; 23 1.8,-2.925; 24 2.2,-2.925; 37 2.2,2.925; 38 1.8,2.925; 39 1.4,2.925; 40 1,2.925; 41 0.6,2.925; 42 0.2,2.925; 43 -0.2,2.925; 44 -0.6,2.925; 45 -1,2.925; 46 -1.4,2.925; 47 -1.8,2.925; 48 -2.2,2.925 | smd 4.4 x 4.4: 49 0,0
IC-MEMORY_SO08 = smd 0.6 x 1.2: 1 -1.905,-2.8; 2 -0.635,-2.8; 3 0.635,-2.8; 4 1.905,-2.8; 5 1.905,2.8; 6 0.635,2.8; 7 -0.635,2.8; 8 -1.905,2.8
JSTPH2 = smd 1 x 4.6: 1 -1,-3.7; 2 1,-3.7 | smd 1.6 x 3.4: NC1 -3.4,1.5; NC2 3.4,1.5
SMD-4 = smd 1.4 x 1.15: 1 -1.1,-0.8; 2 1.1,-0.8; 3 1.1,0.8; 4 -1.1,0.8

### Placement (x,y rotation side)
B0  7.11,43.31 0 top
B1  7.11,42.16 0 top
B2  7.11,41.02 0 top
B3  7.11,39.88 0 top
C1  29.46,50.29 0 top
C2  25.53,32 180 top
C3  25.53,33.15 180 top
C4  25.4,26.42 180 top
C5  5.08,35.18 0 bottom
C6  5.08,33.91 0 bottom
C7  2.79,35.18 180 bottom
C8  14.35,46.48 0 bottom
C9  20.45,43.56 90 bottom
C10  20.45,39.12 270 bottom
C11  11.56,37.21 90 bottom
C12  19.18,43.56 90 bottom
C13  14.99,16.26 0 bottom
C14  14.99,17.4 0 bottom
C15  17.4,11.18 180 bottom
C16  17.4,10.03 180 bottom
C17  17.4,8.89 180 bottom
C18  11.81,8 270 bottom
C19  10.29,8 270 bottom
C20  12.19,10.92 90 bottom
C21  10.67,10.92 90 bottom
C22  14.1,14.61 90 bottom
C23  12.57,14.61 90 bottom
C24  20.57,13.21 90 bottom
C25  22.1,13.21 90 bottom
C26  17.65,5.59 180 bottom
C27  17.65,4.06 180 bottom
C28  19.18,27.3 270 bottom
C29  8.64,12.57 0 bottom
C30  12.95,22.48 90 top
C31  11.68,22.48 90 top
C32  24.77,21.59 90 bottom
D1  30.35,52.96 180 top
D2  30.35,31.37 180 top
D3  27.3,47.37 90 top
D4  12.32,26.8 270 bottom
D5  16.76,27.3 90 bottom
J1  30.05,37.67 90 top
J2  3.56,41.4 270 bottom
J3  5.08,14.22 270 top
J4  27.94,14.22 270 top
J5  16.51,1.52 0 top
MGT1  30.35,2.67 0 top
MGT2  2.67,52.45 0 top
R1  31.37,50.8 270 top
R2  30.86,44.07 0 top
R3  23.88,32.64 90 top
R4  31.24,29.08 270 top
R5  1.02,31.62 90 bottom
R6  1.02,34.54 90 bottom
R7  2.79,33.91 0 bottom
R8  11.56,44.32 270 bottom
R9  15.88,32.51 180 top
R10  10.41,31.75 0 bottom
R11  7.87,31.75 180 bottom
R12  16.13,18.54 0 bottom
R13  11.05,26.8 270 bottom
R14  17.91,27.3 90 bottom
R15  8.76,9.14 270 bottom
R16  12.32,20.83 180 top
R17  18.67,21.59 270 bottom
R18  19.94,21.59 270 bottom
R19  17.4,21.59 270 bottom
R20  30.99,6.35 0 bottom
SW1  9.02,27.05 0 top
SW2  18.8,27.05 180 top
U1  25.37,43.1 270 top
U2  30.48,47.12 180 top
U3  25.02,29.21 180 top
U4  3.28,33.68 270 top
U5  16,40.51 180 top
U6  16.51,10.41 270 top
U7  20.19,19.05 270 top
X1  26.42,51.56 0 bottom
Y1  11.81,18.54 180 top
Y2  8.89,11.81 270 top

### Tracks (layer width: path | path; a pad name or v marks a point on that pad's centre or on a via)
1.8V  (via drill 0.25)
  Top 0.152: U6.6 16.71,14.66 | v16.76,14.73 16.76,14.71 16.71,14.66 | v16.89,16.26 16.89,14.99 16.71,14.8 16.71,14.66
  Top 0.254: U4.5 5.06,32.4 v5.08,32.38 | U6.30 16.31,5.63 v16.26,5.59 | U6.46 20.32,11.81 v20.45,11.94
  Bottom 0.152: R12.P$1 16.89,18.54 v16.89,16.26
  Bottom 0.254: C6.P$1 5.63,32.94 v5.08,32.38 5.08,25.27 7.37,22.99 15.11,22.99 15.62,22.48 15.62,19.6 R12.P$1 | 17.27,11.94 v20.45,11.94 | 17.27,11.94 16.85,11.52 C15.P$1 C16.P$1 C17.P$1 16.26,8.3 v16.26,5.59 | 17.27,11.94 17.25,11.96 17.2,11.96 16.76,12.4 v16.76,14.73
3.3V  (via drill 0.25)
  Top 0.152: 9.64,36.76 v9.58,36.7
  Top 0.254: U5.48 9.64,36.76 | U5.30 13.25,45.68 v13.59,45.34 | U5.26 15.25,45.58 v15,45.33 | U5.21 17.75,45.56 v17.53,45.34 | U5.7 22.59,39.76 v22.61,39.75 | U5.14 22.52,43.26 v22.61,43.18 | U5.13 22.39,42.76 v22.61,42.55 | C4.P$1 25.95,27.89 U3.5 | D2.ANODE v28.57,31.37 | U4.1 5.1,34.96 v5.14,34.92 | U5.3 v20.5,37.77 | U6.23 11.08,8.61 v11.05,8.65 | U6.19 11.53,10.21 v11.43,10.31 | U7.8 v24,20.95 | U6.32 17.11,4.91 v17.03,4.83 | U6.47 20.04,12.21 20.25,12.42 21.18,12.42 v21.34,12.57 | U6.11 14.71,14.25 14.35,14.61 v13.34,14.61 | U6.12 14.31,13.88 14.22,13.97 v13.34,13.97 | v8.13,13.97 8.13,12.95 Y2.1 | Y2.4 9.69,11.85 v9.65,11.81
  Bottom 0.152: 17.03,5.51 C26.P$1 | C21.P$1 10.73,10.31 | 11.52,36.7 C11.P$1
  Bottom 0.254: 10.73,10.31 v11.43,10.31 12.13,10.31 C20.P$1 | v9.58,36.7 11.52,36.7 | R8.P$1 12.36,44.87 v12.45,44.96 | C8.P$1 14.9,45.42 v15,45.33 | C10.P$1 22.52,39.67 v22.61,39.75 | C5.P$1 5.38,34.92 v5.14,34.92 | R6.P$2 v1.02,36.07 | C19.P$1 10.38,8.65 v11.05,8.65 11.72,8.65 C18.P$1 | v24,20.95 24.68,20.95 C32.P$1 v24.77,20.12 | C27.P$1 17.03,4.14 v17.03,4.83 17.03,5.51 | C24.P$1 21.25,12.66 v21.34,12.57 21.42,12.66 C25.P$1 | C23.P$1 13.25,14.05 v13.34,13.97 | v13.34,13.97 13.42,14.05 C22.P$1 | v13.34,14.61 v13.34,13.97 | C29.P$1 9.65,12.11 v9.65,11.81 | R14.P$1 17.91,26.8 v18.41,27.3 | J2.1 v5.08,42.67 | R13.P$1 10.33,27.35 v10.29,27.3
  other vias: 17.4,23.11 18.67,23.11 19.94,23.11 16.4,45.33 20.45,42.04 19.81,42.29 19.18,42.04 19.81,41.66 27.05,26.42 27.05,27.3 27.05,28.19 27.05,29.08 27.94,29.08 27.94,28.19 27.94,27.3 27.94,26.42 28.83,26.42 28.83,27.3 28.83,28.19 28.83,29.08 28.45,25.65 27.56,25.65 26.16,29.08
  pour Route15: 0.76,60.2 32.26,60.2 32.26,0.76 0.76,0.76
  pour Top: 13.21,45.59 13.21,45.09 13.59,44.7 17.4,44.7 17.78,45.09 17.78,45.59
  pour Bottom: 20.7,41.53 18.92,41.53 18.54,41.91 18.54,43.31 21.08,43.31 21.08,41.91
  pour Top: 25.78,28.96 25.78,25.78 26.16,25.4 26.29,25.27 28.57,25.27 29.08,25.78 29.08,26.29 29.08,29.08 28.7,29.46 26.16,29.46 25.78,29.08
  pour Bottom: 16.89,23.24 16.89,22.23 17.02,22.1 20.32,22.1 20.45,22.23 20.45,23.24 20.32,23.37 17.14,23.37 17.02,23.37
16MHZ_IN
  Top 0.152: U6.9 15.51,14.84 13.97,16.38 13.97,18.92 13.55,19.34 Y1.1 12.87,19.38 R16.P$1 12.87,21.84 C30.P$1
16MHZ_OUT
  Top 0.152: U6.10 15.11,14.61 13.34,16.38 11.05,16.38 10.71,16.72 Y1.3 11.39,17.74 11.77,18.12 R16.P$2 11.77,21.84 C31.P$1
32KHZ_CLK
  Top 0.152: U6.20 10.59,9.81 Y2.3
CGND
  Top 0.254: 30.78,36.47 J1.S5 J1.S1 | 30.78,38.87 J1.S6 J1.S2 | MGT1.P$1 32.38,4.7 32.38,32.64 32.13,32.89
  Bottom 0.254: MGT1.P$1 31.54,3.85 R20.P$1
  pour Top: 32.38,42.55 28.83,42.55 27.94,41.66 27.94,40.39 28.32,40.01 29.72,40.01 29.84,39.88 29.84,35.31 29.72,35.18 28.07,35.18 27.94,35.05 27.94,33.66 28.83,32.77 32.38,32.77
CS0
  Top 0.152: J3.P$3 6.48,16.64 6.48,7.11 8,5.59 14.1,5.59 15.11,6.6 U6.27
DBG_RESET  (via drill 0.25)
  Top 0.152: U5.34 9.58,43.76 v9.53,43.81
  Bottom 0.152: R8.P$2 11.52,43.81 v9.53,43.81 8.13,43.81 5.71,41.4 J2.3
DBG_SWDCLK  (via drill 0.25)
  Top 0.152: v17.27,47.75 17.27,46.33 U5.22
  Bottom 0.152: v17.27,47.75 16.64,48.39 4.45,48.39 1.91,45.85 1.91,42.29 2.79,41.4 J2.4
DBG_SWDIO  (via drill 0.25)
  Top 0.152: v15.75,47.24 U5.25
  Bottom 0.152: v15.75,47.24 15.11,47.88 4.57,47.88 2.41,45.72 2.41,43.05 2.79,42.67 J2.2
DBG_SWO  (via drill 0.25)
  Top 0.152: v16.51,47.24 16.25,46.99 U5.24
  Bottom 0.152: v16.51,47.24 16.51,46.1 13.57,43.16 8.6,43.16 6.22,40.78 3.44,40.78 2.92,40.26 J2.6
GND  (via drill 0.25)
  Top 0.152: U7.4 v16.26,17.14 | Y1.4 12.91,16.86 v12.95,16.82 | Y1.2 10.71,20.28 v10.67,20.32 | 9.6,37.26 v9.58,37.29
  Top 0.254: U5.47 9.6,37.26 | U5.31 12.75,47.12 v12.83,47.19 | U5.4 22.7,38.26 v22.73,38.23 | U3.2 25.02,31.96 C2.P$2 24.98,32.64 | 24.98,32.64 C3.P$2 24.98,33.99 v25.02,34.04 | 24.98,32.64 v25.53,32.64 | J1.5 27.66,38.97 v27.56,38.86 | v22.61,43.81 22.55,43.76 U5.15 | U5.16 22.42,44.26 v22.61,44.45 | U1.1 24.35,44.61 v24.13,44.83 | R4.P$2 v31.24,27.69 | U2.2 v30.48,49.53 30.48,49.83 C1.P$2 | U4.2 3.28,35.79 v3.43,35.94 | C4.P$2 v23.75,26.42 | Y2.2 8.09,11.73 v8.13,11.77 | SW2.P$1 18.86,25.98 v18.8,25.91 18.73,25.98 SW2.P$2 | SW1.P$2 v9.08,28.13 SW1.P$1 | C31.P$2 12.32,22.39 | 12.32,22.39 v12.32,22.35 | C30.P$2 12.32,22.39 | R2.P$1 30.35,44.03 v30.35,43.18
  Bottom 0.152: 11.47,11.47 v11.43,11.43 11.39,11.47 | C17.P$2 18.16,8.89
  Bottom 0.254: C20.P$2 11.47,11.47 | C21.P$2 11.39,11.47 | C11.P$2 11.08,37.29 v9.58,37.29 | C8.P$2 13.8,46.99 13.6,47.19 v12.83,47.19 | C10.P$2 20.79,38.23 v22.73,38.23 | R20.P$2 30.44,7.32 v30.48,7.37 | C32.P$2 v24.77,23.11 | C27.P$2 18.2,4.29 v18.74,4.83 18.2,5.37 C26.P$2 | C24.P$2 21.17,13.76 v21.34,13.59 21.5,13.76 C25.P$2 | C23.P$2 12.66,15.24 v13.34,15.24 14.01,15.24 C22.P$2 | C18.P$2 11.77,7.49 v11.05,7.49 10.33,7.49 C19.P$2 | R15.P$2 v8.76,7.62 | C29.P$2 8.13,12.53 v8.13,11.77 | C28.P$2 19.18,26.25 18.84,25.91 v18.8,25.91 17.31,25.91 D5.1 | J2.5 v5.08,40.13 | D4.1 v12.32,28.83
  other vias: 20.45,44.96 19.81,44.7 19.18,44.96 27.3,36.96 26.67,37.59 26.04,38.23 24,40.51 24.77,39.75 25.27,40.39 24.77,40.89 24.77,41.53 26.04,41.53 26.54,41.02 26.8,40.26 24,41.27 27.05,39.37 27.43,40.01 23.75,38.23 24.64,38.23 24,39.75 19.81,45.34 24.64,50.8 24.13,49.91 24.13,48.9 24.13,45.85 24.13,46.86 24.13,47.88 4.45,35.94 3.94,33.91 14.73,12.19 15.62,12.19 17.4,12.45 14.73,10.41 14.73,8.64 18.41,12.45 18.41,8.38 17.4,9.4 17.4,10.54 17.4,8.38 15.62,10.41 15.62,11.3 14.73,9.53 14.73,11.3 18.41,10.54 18.41,9.4 15.62,9.53 15.62,8.51
  pour Route2: 0.76,60.2 32.26,60.2 32.26,0.76 0.76,0.76
  pour Top: 23.62,40.01 27.05,36.58 27.69,36.58 27.69,40.13 26.04,41.78 24,41.78 23.62,41.4
  pour Bottom: 22.73,38.1 26.16,38.1 27.56,39.5 27.56,40.13 26.67,41.02 25.4,41.02 24.26,39.88 23.11,39.88 22.61,39.37 22.61,38.23
  pour Bottom: 20.7,45.47 18.92,45.47 18.54,45.09 18.54,43.69 21.08,43.69 21.08,45.09
  pour Bottom: 26.16,44.45 26.16,50.8 25.78,51.18 24.38,51.18 23.75,50.55 23.75,44.7 24.38,44.07 25.78,44.07
  pour Bottom: 4.83,36.2 3.05,36.2 3.05,33.66 4.83,33.66
  pour Top: 14.48,12.45 14.48,8.38 18.54,8.38 18.54,12.45
  pour Bottom: 17.78,11.56 17.78,8.64 18.67,8.64 18.67,11.3 18.41,11.56
IO1  (via drill 0.25)
  Top 0.152: U6.26 14.71,6.93 v13.84,6.07 | v24.89,15.11 26.04,16.26 26.04,20.07 26.54,20.57 J4.P$2
  Bottom 0.152: v13.84,6.07 13.97,6.2 13.97,12.57 16.64,15.24 24.77,15.24 v24.89,15.11
IO9
  Top 0.152: U6.33 17.51,4.17 17.02,3.68 10.16,3.68 8.89,2.41 J5.P$1
IO10
  Top 0.152: U6.34 17.91,4.07 17.14,3.3 12.32,3.3 11.43,2.41 J5.P$2
IO11
  Top 0.152: U6.35 18.31,3.96 17.27,2.92 14.48,2.92 13.97,2.41 J5.P$3
IO19  (via drill 0.25)
  Top 0.152: U6.41 21.62,9.81 v21.72,9.91
  Bottom 0.152: v21.72,9.91 21.72,6.1 17.14,1.52 J5.P$4
IO20  (via drill 0.25)
  Top 0.152: U6.42 21.01,10.21 21.21,10.41 v22.23,10.41
  Bottom 0.152: v22.23,10.41 22.23,5.97 19.05,2.79 J5.P$5
IO21  (via drill 0.25)
  Top 0.152: U6.43 20.9,10.61 21.21,10.92 v22.73,10.92
  Bottom 0.152: v22.73,10.92 22.73,5.84 21.59,4.7 J5.P$6
IO22  (via drill 0.25)
  Top 0.152: U6.44 20.79,11.01 21.21,11.43 v23.24,11.43
  Bottom 0.152: v23.24,11.43 23.24,5.84 24.13,4.95 J5.P$7
JTAG_TCK  (via drill 0.25)
  Top 0.152: U6.13 13.17,12.61 9.7,16.08 9.7,25.2 v9.78,25.27
  Bottom 0.152: v9.78,25.27 9.78,31.66 R10.P$2
JTAG_TDI  (via drill 0.25)
  Top 0.152: U6.16 12.72,11.41 11.51,12.62 v11.51,12.65 | v13.97,20.32 13.97,31.16 R9.P$2
  Bottom 0.152: v11.51,12.65 11.51,17.86 v13.97,20.32
JTAG_TDO  (via drill 0.25)
  Top 0.152: U6.14 13.06,12.21 9.27,16 v9.27,24.82 | v23.24,37.21 23.19,37.26 U5.2
  Bottom 0.152: v9.27,24.82 22.53,24.82 23.32,25.6 23.32,37.13 v23.24,37.21
JTAG_TMS  (via drill 0.25)
  Top 0.152: U6.15 12.95,11.81 8.89,15.88 8.89,20.07 7.37,21.59 v7.37,24.38
  Bottom 0.152: R11.P$1 7.32,24.43 v7.37,24.38
MISO
  Top 0.152: J3.P$5 6.1,11.94 6.1,6.86 8.51,4.45 14.48,4.45 15.91,5.88 U6.29
MOSI  (via drill 0.25)
  Top 0.152: v14.22,4.95 15.51,6.24 U6.28
  Bottom 0.152: J3.P$6 6.22,9.27 6.22,7.11 8.38,4.95 v14.22,4.95
N$1
  Top 0.152: U3.3 24.07,31.9 R3.P$1
N$2
  Top 0.152: R4.P$1 31.1,29.77 D2.CATHODE
N$3
  Top 0.254: R1.P$1 31.37,52.69 D1.CATHODE
N$4  (via drill 0.25)
  Top 0.152: U4.3 2.33,35.9 v2.29,35.94
  Bottom 0.152: v2.29,35.94 2.29,35.22 C7.P$1 | C7.P$1 R7.P$2 | R5.P$2 1.31,32.17 1.65,32.51 1.65,34.54 1.63,34.56 | C7.P$1 1.63,34.56 | 1.63,34.56 1.06,33.99 R6.P$1
N$5
  Top 0.152: U2.5 31.43,44.09 R2.P$2
N$6
  Top 0.254: U2.1 31.43,50.19 R1.P$2
N$7  (via drill 0.25)
  Top 0.152: U6.21 9.86,9.41 v9.65,9.62
  Bottom 0.152: v9.65,9.62 8.84,9.62 R15.P$1
N$8  (via drill 0.25)
  Top 0.152: U5.63 19.25,33.83 v19,33.58
  Bottom 0.152: v19,33.58 9.73,33.58 8.42,32.28 R11.P$2
N$9  (via drill 0.25)
  Top 0.152: U5.62 18.75,33.99 v17.91,33.15
  Bottom 0.152: v17.91,33.15 12.36,33.15 R10.P$1
N$10  (via drill 0.25)
  Top 0.152: U6.8 15.91,15.08 v15.49,15.49
  Bottom 0.152: C14.P$2 C13.P$2 15.2,15.49 v15.49,15.49
N$11
  Top 0.152: U5.59 17.25,33.2 16.56,32.51 R9.P$1
N$12
  Top 0.152: U5.35 7.16,43.26 B0.TP
N$13
  Top 0.152: U5.36 7.71,42.76 B1.TP
N$14
  Top 0.152: U5.37 8.35,42.26 B2.TP
N$15
  Top 0.152: U5.38 9,41.76 B3.TP
PLL_AVDD  (via drill 0.25)
  Top 0.152: v16.26,16.26 16.31,16.2 U6.7
  Bottom 0.152: R12.P$2 15.54,18.5 C14.P$1 C13.P$1 v16.26,16.26
PWM  (via drill 0.25)
  Top 0.152: U6.25 14.31,6.94 14.22,6.86 v13.46,6.86 | v24.8,15.72 25.65,16.57 25.65,22.61 26.16,23.11 J4.P$1
  Bottom 0.152: v13.46,6.86 13.46,12.57 16.51,15.62 24.7,15.62 v24.8,15.72
QSPI_CS  (via drill 0.25)
  Top 0.152: U6.5 17.11,14.02 17.12,14.03 17.12,14.45 20.45,17.78 20.45,20.45 19.94,20.95 U7.1 v16.26,20.95
  Bottom 0.152: R19.P$2 16.34,21.04 v16.26,20.95
QSPI_DQ0
  Top 0.152: U6.4 17.51,14.34 20.32,17.14 U7.5
QSPI_DQ1  (via drill 0.25)
  Top 0.152: U6.3 17.91,14.23 20.32,16.64 v20.95,16.64 | v19.94,19.68 U7.2
  Bottom 0.152: v19.94,19.68 20.95,18.67 v20.95,16.64
QSPI_DQ2  (via drill 0.25)
  Top 0.152: U6.2 18.31,13.99 v20.45,16.13 | v19.94,18.41 U7.3
  Bottom 0.152: v20.45,16.13 20.45,17.91 v19.94,18.41 18.67,19.68 R17.P$2
QSPI_DQ3  (via drill 0.25)
  Top 0.152: U6.1 18.71,13.76 19.68,14.73 22.43,14.73 v23.82,16.13 | U7.7 23.88,19.68 24.77,18.8 v24.77,17.14
  Bottom 0.152: v23.82,16.13 24.77,17.07 v24.77,17.14 23.83,17.14 R18.P$2
QSPI_SCK
  Top 0.152: U6.48 19.85,12.61 20.37,13.13 23.04,13.13 24.26,14.35 24.26,18.03 23.88,18.41 U7.6
RESET  (via drill 0.25)
  Top 0.152: J3.P$2 5.08,20.32 6.86,18.54 6.86,9.65 8.3,8.21 U6.24 | SW2.P$3 SW2.P$4 14.54,28.13 v14.48,28.07 | v14.48,20.83 v14.48,28.07 | U5.64 19.75,33.34 v14.48,28.07
  Bottom 0.152: C28.P$1 R14.P$2 17.06,27.86 D5.2 16.68,28.07 v14.48,28.07 | J3.P$2 5.33,20.83 v14.48,20.83
RXI
  Top 0.152: J4.P$3 26.92,18.03 26.42,17.53 26.42,15.88 22.35,11.81 21.08,11.81 20.68,11.41 U6.45
SCK  (via drill 0.25)
  Top 0.152: U6.31 16.71,5.15 16.38,4.83 v16.26,4.83
  Bottom 0.152: J3.P$4 6.6,13.97 6.6,7.37 8.46,5.51 14.81,5.51 15.49,4.83 v16.26,4.83
SCL
  Top 0.152: U6.37 23.2,8.21 J4.P$5
SDA
  Top 0.152: U6.36 18.71,6.82 19.05,6.48 24,6.48 J4.P$6
TXO
  Top 0.152: U6.40 21.99,9.41 27.94,15.37 J4.P$4
UART_RX_MK22  (via drill 0.25)
  Top 0.152: U6.39 22.22,9.01 v25.65,12.45 | U5.39 9.26,41.26 7.87,39.88 v7.87,30.99
  Bottom 0.152: v25.65,12.45 25.65,23.11 24.89,23.88 8.64,23.88 7.87,24.64 v7.87,30.99
UART_TX_MK22  (via drill 0.25)
  Top 0.152: U5.40 9.52,40.76 8.38,39.62 v8.38,30.48 | v26.19,12.16 22.65,8.61 U6.38
  Bottom 0.152: v8.38,30.48 8.38,24.89 8.89,24.38 24.89,24.38 26.19,23.08 v26.19,12.16
USB_N  (via drill 0.25)
  Top 0.152: v23.22,39.3 23.17,39.26 U5.6 | U1.2 25.01,42.15 25.23,41.93 25.23,41.15 25.78,40.6 v25.78,39.85 25.78,39.17 27.94,37.02 J1.2
  Bottom 0.152: v23.22,39.3 25.23,39.3 v25.78,39.85
USB_P  (via drill 0.25)
  Top 0.152: v23.22,38.72 23.17,38.76 U5.5 | U1.3 25.52,42.15 25.51,42.15 25.51,41.27 26.26,40.52 v26.26,39.37 27.96,37.67 J1.3
  Bottom 0.152: v23.22,38.72 25.61,38.72 v26.26,39.37
V_BATT  (via drill 0.25)
  Top 0.254: D3.A 27.3,48.13
  other vias: 28.45,48.01 28.45,49.02 28.45,50.04 27.94,50.67 27.3,50.67
  pour Top: 28.83,51.18 25.91,51.18 25.53,50.8 25.53,47.75 25.91,47.37 28.96,47.37 29.59,48.01 29.59,50.42
  pour Bottom: 27.05,51.18 28.32,51.18 29.08,50.42 29.08,45.72 26.67,45.72 26.67,50.8
V_USB  (via drill 0.25)
  Top 0.254: 26.72,36.37 27.56,36.37 | 27.56,36.37 J1.1 | 26.72,36.37 26.08,35.73 C3.P$1 C2.P$1 25.97,31.9 U3.1 28.67,30.51 29.46,29.72 29.46,9.4 J4.P$7 | R3.P$2 23.88,35.69 24.56,36.37 26.72,36.37 | U1.4 28.81,44.05 v28.83,44.07 | v27.18,35.69 27.18,35.99 27.56,36.37 | D1.ANODE v28.45,52.96
  Bottom 0.254: v27.18,35.69 28.32,35.69 28.83,36.2 v28.83,44.07 29.59,44.83 29.59,50.42 28.45,51.56 v28.45,52.96
  pour Top: 25.53,45.59 25.53,43.69 25.91,43.31 28.96,43.31 29.21,43.31 29.59,43.69 29.59,46.61 29.46,46.74 29.21,46.99 26.67,46.99 25.91,46.99 25.53,46.61
VDD_CORE_EN  (via drill 0.25)
  Top 0.152: U6.22 11.29,9.01 11.17,9.13 7.88,9.13 7.24,9.78 7.24,20.32 v5.71,21.84
  Bottom 0.152: R5.P$1 1.02,24.13 3.3,21.84 v5.71,21.84
WAKE  (via drill 0.25)
  Top 0.152: U6.18 12.88,10.61 10.95,12.55 10.95,13.31 8.51,15.75 8.51,19.81 5.21,23.11 J3.P$1 5.08,25.15 5.91,25.98 SW1.P$3 SW1.P$4 13.28,25.98 v13.34,26.04
  Bottom 0.152: R13.P$2 12.02,26.25 D4.2 12.41,26.04 v13.34,26.04

### Text on the board
tNames: Athena | Nest | WAKE | RESET | Owl | WAKE | PWM | RESET | IO1 | CS0 | RXI | SCK | TXO | MISO | SCL | MOSI | SDA | 3.3V | 5V | GND | GND | RISC | - | V | IO9 | IO10 | IO11 | IO19 | IO20 | IO21 | IO22
bNames: Rev A1 | WAKE | PWM | RESET | IO1 | CS0 | RXI | SCK | TXO | MISO | SCL | MOSI | SDA | 3.3V | 5V | GND | IO9 | IO10 | IO11 | IO19 | IO20 | IO21 | IO22